# Altium project AX301_AX4010.PrjPCB
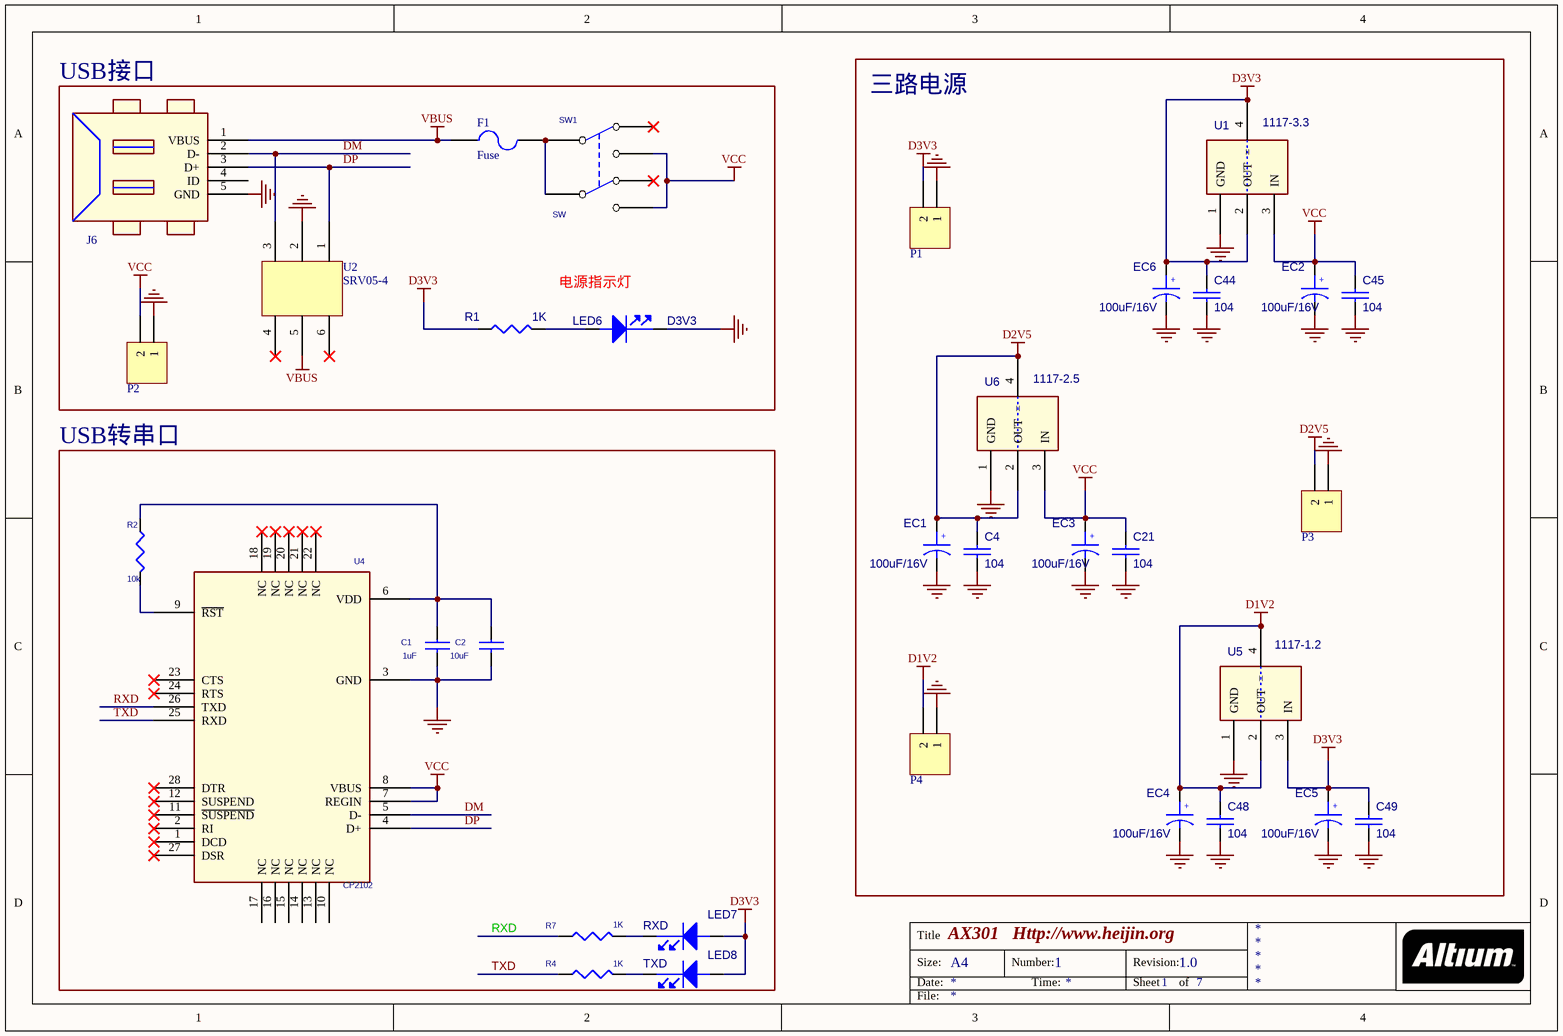
[diagram p0: 1_POWER.SchDoc]
7 sheets, 184 parts. Net scope: global (net labels, ports and power ports of the same name join across sheets).
Sheets:
  1_POWER.SchDoc
  2_FPGA.SchDoc
  3_FPGA.SchDoc
  4_FPGA.SchDoc
  5_SDRAM.SchDoc
  6_DIG.SchDoc
  7_VGA.SchDoc

## Sheet 1_POWER.SchDoc: AX301   Http://www.heijin.org
size A4; DocumentNumber: 1; Revision: 1.0; SheetNumber: 1; SheetTotal: 7; PageSetup: Record=PageOptions|CenterHorizontal=True|CenterVertical=True|PrintScale=1.00|XCorrection=1.00|YCorrection=1.00|PrintKind=0|BorderSize=5000000|LeftOffset=0|BottomOffset=0|Orientation=2|PaperLength=1000|PaperWidth=1000|Scale=100|PaperSource=7|PrintQuality=-4|MediaType=1|DitherType=10|PrintScaleMode=1|PaperKind=A4|PaperIndex=9

### Parts
C1  1uF  [0603]
C2  10uF  [0805]
C4  104  [0402]
C21  104  [0402]
C44  104  [0402]
C45  104  [0402]
C48  104  [0402]
C49  104  [0402]
EC1  100uF/16V  [AEC6.5]
EC2  100uF/16V  [AEC6.5]
EC3  100uF/16V  [AEC6.5]
EC4  100uF/16V  [AEC6.5]
EC5  100uF/16V  [AEC6.5]
EC6  100uF/16V  [AEC6.5]
F1  Fuse  [1812]
J6  EC2  [MINIUSBB]  (value not drawn)
LED6  D3V3  [LEDSO]
LED7  RXD  [LEDSO]
LED8  TXD  [LEDSO]
P1  3.3V  [HDR1X2]  (value not drawn)
P2  5V  [HDR1X2]  (value not drawn)
P3  3.3V  [HDR1X2]  (value not drawn)
P4  1.2V  [HDR1X2]  (value not drawn)
R1  1K  [0603]
R2  10k  [0603]
R4  1K  [0603]
R7  1K  [0603]
SW1  SW  [KEY_DPDT]
U1  1117-3.3  [SOT223]
U2  SRV05-4  [SOT23-6]
U4  CP2102  [QFN28]
U5  1117-1.2  [SOT223]
U6  1117-2.5  [SOT223]

### Blocks framed on the sheet
USB接口: F1 J6 LED6 P2 R1 SW1 U2
三路电源: C4 C21 C44 C45 C48 C49 EC1-EC6 P1 P3 P4 U1 U5 U6
USB转串口: C1 C2 LED7 LED8 R2 R4 R7 U4

### Nets
D1V2: C48.1 EC4.1 P4.2 U5.2(OUT) U5.4(=)
D2V5: C4.1 EC1.1 P3.2 U6.2(OUT) U6.4(=)
D3V3: C44.1 C49.1 EC5.1 EC6.1 LED7.1(ANODE) LED8.1(ANODE) P1.2 R1.1 U1.2(OUT) U1.4(=) U5.3(IN)
GND: C1.2 C2.2 C4.2 C21.2 C44.2 C45.2 C48.2 C49.2 EC1.2 EC2.2 EC3.2 EC4.2 EC5.2 EC6.2 J6.5(GND) LED6.2(CATHODE) P1.1 P2.1 P3.1 P4.1 U1.1(GND) U2.2 U4.3(GND) U5.1(GND) U6.1(GND)
VBUS: F1.1 J6.1(VBUS) U2.5
VCC: C21.1 C45.1 EC2.1 EC3.1 P2.2 SW1.3(NO1) SW1.6(NO2) U1.3(IN) U4.7(REGIN) U4.8(VBUS) U6.3(IN)
DM: J6.2(D-) U2.3 U4.5(D-)
DP: J6.3(D+) U2.1 U4.4(D+)
RXD: R7.1 U4.26(TXD)
TXD: R4.1 U4.25(RXD)
NetC1_1: C1.1 C2.1 R2.2 U4.6(VDD)
NetF1_2: F1.2 SW1.2(COMMON1) SW1.5(COMMON2)
NetLED6_1: LED6.1(ANODE) R1.2
NetLED7_2: LED7.2(CATHODE) R7.2
NetLED8_2: LED8.2(CATHODE) R4.2
NetR2_1: R2.1 U4.9(~{RST})

Not connected (* = marked no-connect by the designer): J6 4(ID); SW1 1(NC1)* 4(NC2)*; U2 4* 6*; U4 1(DCD)* 2(RI)* 10(NC) 11(~{SUSPEND})* 12(SUSPEND)* 13(NC) 14(NC) 15(NC) 16(NC) 17(NC) 18(NC)* 19(NC)* 20(NC)* 21(NC)* 22(NC)* 23(CTS)* 24(RTS)* 27(DSR)* 28(DTR)*

### Notes on the sheet
- 电源指示灯
- Title
- Size:
- Date:
- A4
- Number:
- Time:
- Revision:
- Sheet
- of
- File:
- (in symbol EC) +

### Library data of the parts
C1 C2 = CAP NP_Dup2
C4 C21 C44 C45 C48 C49 = C_Dup4
EC1-EC6 = EC
F1 = Fuse 2: Published: 8-Jun-2000; LatestRevisionDate: 17-Jul-2002; LatestRevisionNote: Re-released for DXP Platform.; PackageReference: PIN-W2/E2.8; Publisher: Altium Limited; PackageDescription: Thru-Hole; 2 Leads
J6 = MiniUSBB: R50: J5
LED6 = LED_Dup1
LED7 LED8 = LED
P1-P4 = Header 2: Header, 2-Pin; LatestRevisionDate: 17-Jul-2002; LatestRevisionNote: Re-released for DXP Platform.; Publisher: Altium Limited
R1 = R
R2 = RESISTOR
R4 R7 = R_Dup3
SW1 = SW KEY-DPDT
U4 = CP2102_0
U5 U6 = 1117-3.3

## Sheet 2_FPGA.SchDoc: AX301 Http://www.heijin.org
size OrCAD A; DocumentNumber: 2; Revision: 1.0; SheetNumber: 2; SheetTotal: 7; PageSetup: Record=PageOptions|CenterHorizontal=True|CenterVertical=True|PrintScale=1.03|XCorrection=1.00|YCorrection=1.00|PrintKind=0|BorderSize=5000000|LeftOffset=0|BottomOffset=0|Orientation=2|PaperLength=1000|PaperWidth=1000|Scale=100|PaperSource=15|PrintQuality=1200|MediaType=1|DitherType=10|PrintScaleMode=1|PaperKind=A4|PaperIndex=9
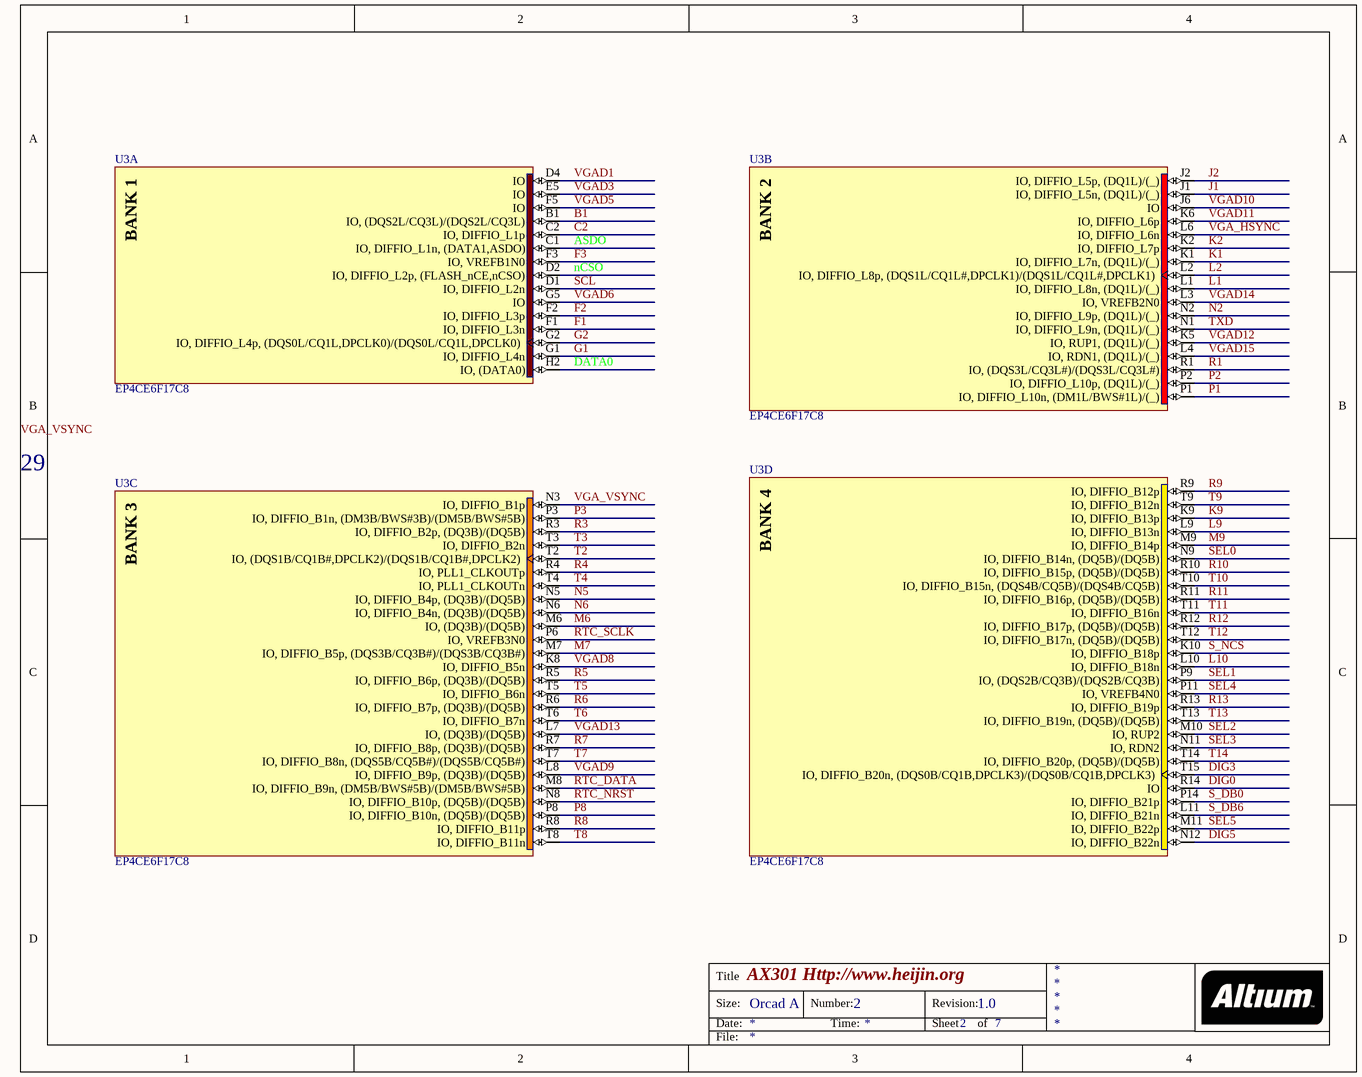
[diagram p1: 2_FPGA.SchDoc]

### Parts
U3  EP4CE6F17C8  [FBGA256]  (parts A,B,C,D of 13)

### Nets
ASDO: U3.C1(IO,_DIFFIO_L1n,_(DATA1,ASDO))
B1: U3.B1(IO,_(DQS2L/CQ3L)/(DQS2L/CQ3L))
C2: U3.C2(IO,_DIFFIO_L1p)
DATA0: U3.H2(IO,_(DATA0))
DIG0: U3.R14(IO)
DIG3: U3.T15(IO,_DIFFIO_B20n,_(DQS0B/CQ1B,DPCLK3)/(DQS0B/CQ1B,DPCLK3))
DIG5: U3.N12(IO,_DIFFIO_B22n)
F1: U3.F1(IO,_DIFFIO_L3n)
F2: U3.F2(IO,_DIFFIO_L3p)
F3: U3.F3(IO,_VREFB1N0)
G1: U3.G1(IO,_DIFFIO_L4n)
G2: U3.G2(IO,_DIFFIO_L4p,_(DQS0L/CQ1L,DPCLK0)/(DQS0L/CQ1L,DPCLK0))
J1: U3.J1(IO,_DIFFIO_L5n,_(DQ1L)/(_))
J2: U3.J2(IO,_DIFFIO_L5p,_(DQ1L)/(_))
K1: U3.K1(IO,_DIFFIO_L7n,_(DQ1L)/(_))
K2: U3.K2(IO,_DIFFIO_L7p)
K9: U3.K9(IO,_DIFFIO_B13p)
L1: U3.L1(IO,_DIFFIO_L8n,_(DQ1L)/(_))
L2: U3.L2(IO,_DIFFIO_L8p,_(DQS1L/CQ1L#,DPCLK1)/(DQS1L/CQ1L#,DPCLK1))
L9: U3.L9(IO,_DIFFIO_B13n)
L10: U3.L10(IO,_DIFFIO_B18n)
M6: U3.M6(IO,_(DQ3B)/(DQ5B))
M7: U3.M7(IO,_DIFFIO_B5p,_(DQS3B/CQ3B#)/(DQS3B/CQ3B#))
M9: U3.M9(IO,_DIFFIO_B14p)
N2: U3.N2(IO,_DIFFIO_L9p,_(DQ1L)/(_))
N5: U3.N5(IO,_DIFFIO_B4p,_(DQ3B)/(DQ5B))
N6: U3.N6(IO,_DIFFIO_B4n,_(DQ3B)/(DQ5B))
nCSO: U3.D2(IO,_DIFFIO_L2p,_(FLASH_nCE,nCSO))
P1: U3.P1(IO,_DIFFIO_L10n,_(DM1L/BWS#1L)/(_))
P2: U3.P2(IO,_DIFFIO_L10p,_(DQ1L)/(_))
P3: U3.P3(IO,_DIFFIO_B1n,_(DM3B/BWS#3B)/(DM5B/BWS#5B))
P8: U3.P8(IO,_DIFFIO_B10n,_(DQ5B)/(DQ5B))
R1: U3.R1(IO,_(DQS3L/CQ3L#)/(DQS3L/CQ3L#))
R3: U3.R3(IO,_DIFFIO_B2p,_(DQ3B)/(DQ5B))
R4: U3.R4(IO,_PLL1_CLKOUTp)
R5: U3.R5(IO,_DIFFIO_B6p,_(DQ3B)/(DQ5B))
R6: U3.R6(IO,_DIFFIO_B7p,_(DQ3B)/(DQ5B))
R7: U3.R7(IO,_DIFFIO_B8p,_(DQ3B)/(DQ5B))
R8: U3.R8(IO,_DIFFIO_B11p)
R9: U3.R9(IO,_DIFFIO_B12p)
R10: U3.R10(IO,_DIFFIO_B15p,_(DQ5B)/(DQ5B))
R11: U3.R11(IO,_DIFFIO_B16p,_(DQ5B)/(DQ5B))
R12: U3.R12(IO,_DIFFIO_B17p,_(DQ5B)/(DQ5B))
R13: U3.R13(IO,_DIFFIO_B19p)
RTC_DATA: U3.M8(IO,_DIFFIO_B9n,_(DM5B/BWS#5B)/(DM5B/BWS#5B))
RTC_NRST: U3.N8(IO,_DIFFIO_B10p,_(DQ5B)/(DQ5B))
RTC_SCLK: U3.P6(IO,_VREFB3N0)
S_DB0: U3.P14(IO,_DIFFIO_B21p)
S_DB6: U3.L11(IO,_DIFFIO_B21n)
S_NCS: U3.K10(IO,_DIFFIO_B18p)
SCL: U3.D1(IO,_DIFFIO_L2n)
SEL0: U3.N9(IO,_DIFFIO_B14n,_(DQ5B)/(DQ5B))
SEL1: U3.P9(IO,_(DQS2B/CQ3B)/(DQS2B/CQ3B))
SEL2: U3.M10(IO,_RUP2)
SEL3: U3.N11(IO,_RDN2)
SEL4: U3.P11(IO,_VREFB4N0)
SEL5: U3.M11(IO,_DIFFIO_B22p)
T2: U3.T2(IO,_(DQS1B/CQ1B#,DPCLK2)/(DQS1B/CQ1B#,DPCLK2))
T3: U3.T3(IO,_DIFFIO_B2n)
T4: U3.T4(IO,_PLL1_CLKOUTn)
T5: U3.T5(IO,_DIFFIO_B6n)
T6: U3.T6(IO,_DIFFIO_B7n)
T7: U3.T7(IO,_DIFFIO_B8n,_(DQS5B/CQ5B#)/(DQS5B/CQ5B#))
T8: U3.T8(IO,_DIFFIO_B11n)
T9: U3.T9(IO,_DIFFIO_B12n)
T10: U3.T10(IO,_DIFFIO_B15n,_(DQS4B/CQ5B)/(DQS4B/CQ5B))
T11: U3.T11(IO,_DIFFIO_B16n)
T12: U3.T12(IO,_DIFFIO_B17n,_(DQ5B)/(DQ5B))
T13: U3.T13(IO,_DIFFIO_B19n,_(DQ5B)/(DQ5B))
T14: U3.T14(IO,_DIFFIO_B20p,_(DQ5B)/(DQ5B))
TXD: U3.N1(IO,_DIFFIO_L9n,_(DQ1L)/(_))
VGA_HSYNC: U3.L6(IO,_DIFFIO_L6n)
VGA_VSYNC: U3.N3(IO,_DIFFIO_B1p)
VGAD1: U3.D4(IO)
VGAD3: U3.E5(IO)
VGAD5: U3.F5(IO)
VGAD6: U3.G5(IO)
VGAD8: U3.K8(IO,_DIFFIO_B5n)
VGAD9: U3.L8(IO,_DIFFIO_B9p,_(DQ3B)/(DQ5B))
VGAD10: U3.J6(IO)
VGAD11: U3.K6(IO,_DIFFIO_L6p)
VGAD12: U3.K5(IO,_RUP1,_(DQ1L)/(_))
VGAD13: U3.L7(IO,_(DQ3B)/(DQ5B))
VGAD14: U3.L3(IO,_VREFB2N0)
VGAD15: U3.L4(IO,_RDN1,_(DQ1L)/(_))

### Notes on the sheet
- 29
- Labels drawn without touching a wire or pin: VGA_VSYNC
- Title
- Size:
- Date:
- Orcad A
- Number:
- Time:
- Revision:
- Sheet
- of
- File:
- (in symbol EP4CE6F17C8, part A) BANK 1
- (in symbol EP4CE6F17C8, part B) BANK 2
- (in symbol EP4CE6F17C8, part C) BANK 3
- (in symbol EP4CE6F17C8, part D) BANK 4

### Library data of the parts
U3 = EP4CE6F17C8: Cyclone IV Family FPGA, 2V Core, 179 I/O Pins, 2 PLLs, 256-Pin FBGA, Speed Grade 8, Commercial Grade; Published: 3-May-2010; DatasheetVersion: ver1.2, Mar-2010; PackageVersion: ver16.0, Dec-2009; PackageReference: FBGA256; Publisher: Altium Limited; PackageDescription: 256-Ball FineLine Ball Grid Array (FBGA256) - Option 1 - Wire Bond; Supplier 1: Digi-Key; Supplier Part Number 1: EP4CE6F17C8-ND; Code_JEDEC: MS-034-AAF-1; Code_IPC: BGA100P16X16-256; ComponentLink1Description: Manufacturer Link; ComponentLink1URL: http://www.altera.com/; ComponentLink2Description: Handbook; ComponentLink2URL: http://www.altera.com/literature/hb/cyclone-iv/cyclone4-handbook.pdf; ComponentLink3Description: Pinout Specification; ComponentLink3URL: http://www.altera.com/literature/lit-dp.jsp?category=cyc%204&showspreadsheet=y; ComponentLink4Description: Packaging Specification; ComponentLink4URL: http://www.altera.com/literature/ds/dspkg.pdf

## Sheet 3_FPGA.SchDoc: AX301  Http://www.heijin.org
size OrCAD A; DocumentNumber: 3; Revision: 1.0; SheetNumber: 3; SheetTotal: 7; PageSetup: Record=PageOptions|CenterHorizontal=True|CenterVertical=True|PrintScale=1.03|XCorrection=1.00|YCorrection=1.00|PrintKind=0|BorderSize=5000000|LeftOffset=0|BottomOffset=0|Orientation=2|PaperLength=1000|PaperWidth=1000|Scale=100|PaperSource=7|PrintQuality=-4|MediaType=1|DitherType=10|PrintScaleMode=1|PaperKind=A4|PaperIndex=9
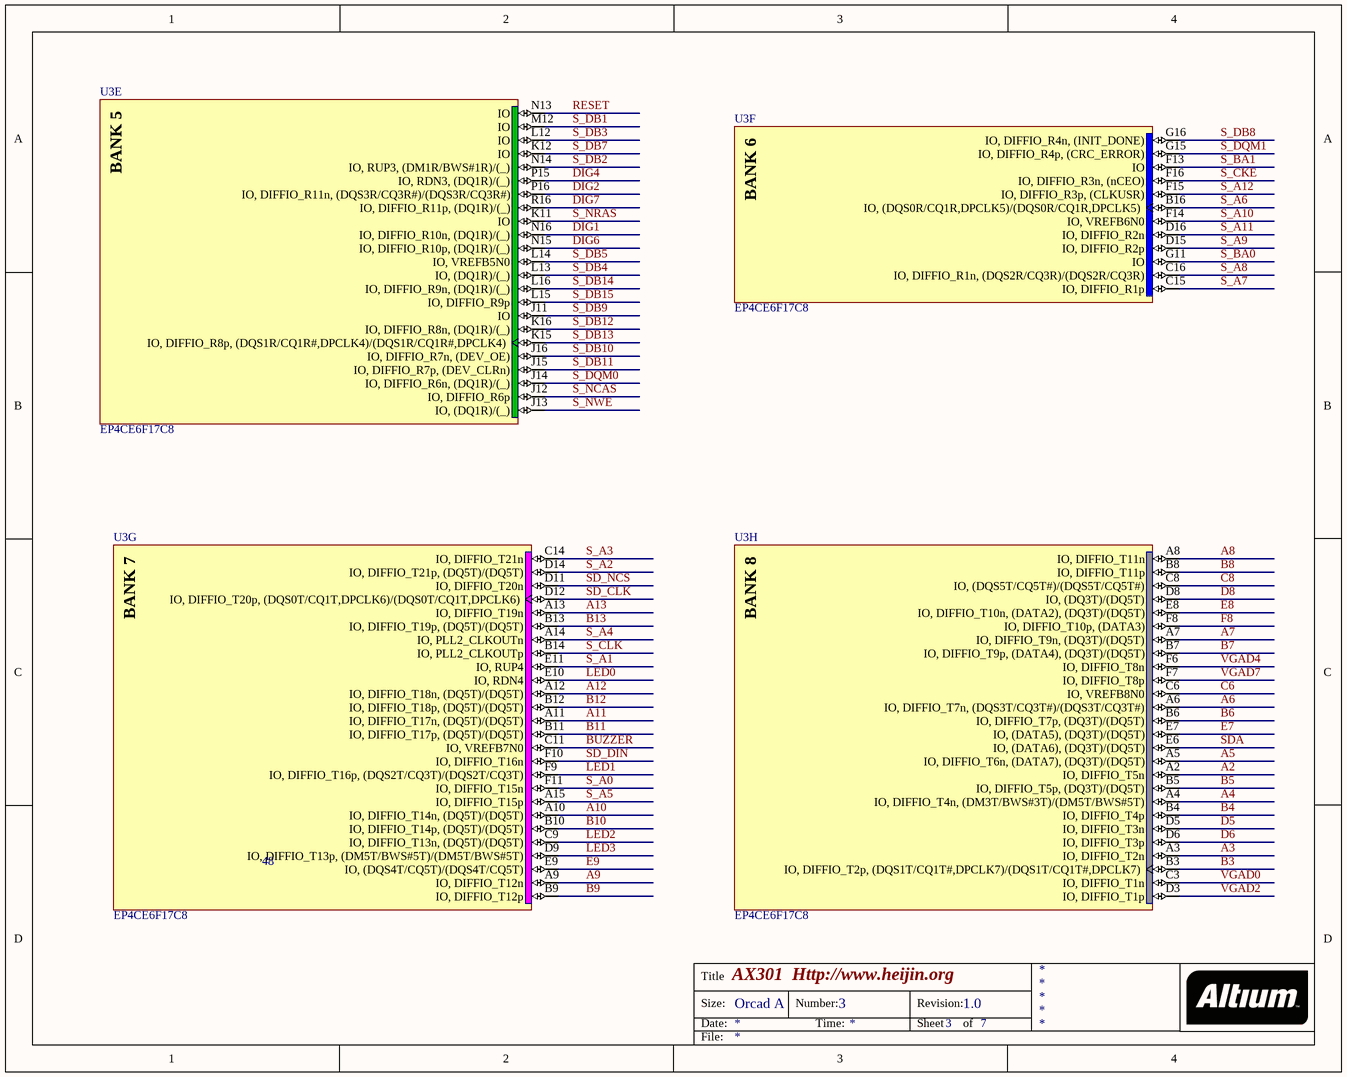
[diagram p2: 3_FPGA.SchDoc]

### Parts
U3  EP4CE6F17C8  [FBGA256]  (parts E,F,G,H of 13)

### Nets
A2: U3.A2(IO,_DIFFIO_T5n)
A3: U3.A3(IO,_DIFFIO_T2n)
A4: U3.A4(IO,_DIFFIO_T4n,_(DM3T/BWS#3T)/(DM5T/BWS#5T))
A5: U3.A5(IO,_DIFFIO_T6n,_(DATA7),_(DQ3T)/(DQ5T))
A6: U3.A6(IO,_DIFFIO_T7n,_(DQS3T/CQ3T#)/(DQS3T/CQ3T#))
A7: U3.A7(IO,_DIFFIO_T9n,_(DQ3T)/(DQ5T))
A8: U3.A8(IO,_DIFFIO_T11n)
A9: U3.A9(IO,_DIFFIO_T12n)
A10: U3.A10(IO,_DIFFIO_T14n,_(DQ5T)/(DQ5T))
A11: U3.A11(IO,_DIFFIO_T17n,_(DQ5T)/(DQ5T))
A12: U3.A12(IO,_DIFFIO_T18n,_(DQ5T)/(DQ5T))
A13: U3.A13(IO,_DIFFIO_T19n)
B3: U3.B3(IO,_DIFFIO_T2p,_(DQS1T/CQ1T#,DPCLK7)/(DQS1T/CQ1T#,DPCLK7))
B4: U3.B4(IO,_DIFFIO_T4p)
B5: U3.B5(IO,_DIFFIO_T5p,_(DQ3T)/(DQ5T))
B6: U3.B6(IO,_DIFFIO_T7p,_(DQ3T)/(DQ5T))
B7: U3.B7(IO,_DIFFIO_T9p,_(DATA4),_(DQ3T)/(DQ5T))
B8: U3.B8(IO,_DIFFIO_T11p)
B9: U3.B9(IO,_DIFFIO_T12p)
B10: U3.B10(IO,_DIFFIO_T14p,_(DQ5T)/(DQ5T))
B11: U3.B11(IO,_DIFFIO_T17p,_(DQ5T)/(DQ5T))
B12: U3.B12(IO,_DIFFIO_T18p,_(DQ5T)/(DQ5T))
B13: U3.B13(IO,_DIFFIO_T19p,_(DQ5T)/(DQ5T))
BUZZER: U3.C11(IO,_VREFB7N0)
C6: U3.C6(IO,_VREFB8N0)
C8: U3.C8(IO,_(DQS5T/CQ5T#)/(DQS5T/CQ5T#))
D5: U3.D5(IO,_DIFFIO_T3n)
D6: U3.D6(IO,_DIFFIO_T3p)
D8: U3.D8(IO,_(DQ3T)/(DQ5T))
DIG1: U3.N16(IO,_DIFFIO_R10n,_(DQ1R)/(_))
DIG2: U3.P16(IO,_DIFFIO_R11n,_(DQS3R/CQ3R#)/(DQS3R/CQ3R#))
DIG4: U3.P15(IO,_RDN3,_(DQ1R)/(_))
DIG6: U3.N15(IO,_DIFFIO_R10p,_(DQ1R)/(_))
DIG7: U3.R16(IO,_DIFFIO_R11p,_(DQ1R)/(_))
E7: U3.E7(IO,_(DATA5),_(DQ3T)/(DQ5T))
E8: U3.E8(IO,_DIFFIO_T10n,_(DATA2),_(DQ3T)/(DQ5T))
E9: U3.E9(IO,_(DQS4T/CQ5T)/(DQS4T/CQ5T))
F8: U3.F8(IO,_DIFFIO_T10p,_(DATA3))
LED0: U3.E10(IO,_RDN4)
LED1: U3.F9(IO,_DIFFIO_T16p,_(DQS2T/CQ3T)/(DQS2T/CQ3T))
LED2: U3.C9(IO,_DIFFIO_T13n,_(DQ5T)/(DQ5T))
LED3: U3.D9(IO,_DIFFIO_T13p,_(DM5T/BWS#5T)/(DM5T/BWS#5T))
RESET: U3.N13(IO)
S_A0: U3.F11(IO,_DIFFIO_T15n)
S_A1: U3.E11(IO,_RUP4)
S_A2: U3.D14(IO,_DIFFIO_T21p,_(DQ5T)/(DQ5T))
S_A3: U3.C14(IO,_DIFFIO_T21n)
S_A4: U3.A14(IO,_PLL2_CLKOUTn)
S_A5: U3.A15(IO,_DIFFIO_T15p)
S_A6: U3.B16(IO,_(DQS0R/CQ1R,DPCLK5)/(DQS0R/CQ1R,DPCLK5))
S_A7: U3.C15(IO,_DIFFIO_R1p)
S_A8: U3.C16(IO,_DIFFIO_R1n,_(DQS2R/CQ3R)/(DQS2R/CQ3R))
S_A9: U3.D15(IO,_DIFFIO_R2p)
S_A10: U3.F14(IO,_VREFB6N0)
S_A11: U3.D16(IO,_DIFFIO_R2n)
S_A12: U3.F15(IO,_DIFFIO_R3p,_(CLKUSR))
S_BA0: U3.G11(IO)
S_BA1: U3.F13(IO)
S_CKE: U3.F16(IO,_DIFFIO_R3n,_(nCEO))
S_CLK: U3.B14(IO,_PLL2_CLKOUTp)
S_DB1: U3.M12(IO)
S_DB2: U3.N14(IO,_RUP3,_(DM1R/BWS#1R)/(_))
S_DB3: U3.L12(IO)
S_DB4: U3.L13(IO,_(DQ1R)/(_))
S_DB5: U3.L14(IO,_VREFB5N0)
S_DB7: U3.K12(IO)
S_DB8: U3.G16(IO,_DIFFIO_R4n,_(INIT_DONE))
S_DB9: U3.J11(IO)
S_DB10: U3.J16(IO,_DIFFIO_R7n,_(DEV_OE))
S_DB11: U3.J15(IO,_DIFFIO_R7p,_(DEV_CLRn))
S_DB12: U3.K16(IO,_DIFFIO_R8n,_(DQ1R)/(_))
S_DB13: U3.K15(IO,_DIFFIO_R8p,_(DQS1R/CQ1R#,DPCLK4)/(DQS1R/CQ1R#,DPCLK4))
S_DB14: U3.L16(IO,_DIFFIO_R9n,_(DQ1R)/(_))
S_DB15: U3.L15(IO,_DIFFIO_R9p)
S_DQM0: U3.J14(IO,_DIFFIO_R6n,_(DQ1R)/(_))
S_DQM1: U3.G15(IO,_DIFFIO_R4p,_(CRC_ERROR))
S_NCAS: U3.J12(IO,_DIFFIO_R6p)
S_NRAS: U3.K11(IO)
S_NWE: U3.J13(IO,_(DQ1R)/(_))
SD_CLK: U3.D12(IO,_DIFFIO_T20p,_(DQS0T/CQ1T,DPCLK6)/(DQS0T/CQ1T,DPCLK6))
SD_DIN: U3.F10(IO,_DIFFIO_T16n)
SD_NCS: U3.D11(IO,_DIFFIO_T20n)
SDA: U3.E6(IO,_(DATA6),_(DQ3T)/(DQ5T))
VGAD0: U3.C3(IO,_DIFFIO_T1n)
VGAD2: U3.D3(IO,_DIFFIO_T1p)
VGAD4: U3.F6(IO,_DIFFIO_T8n)
VGAD7: U3.F7(IO,_DIFFIO_T8p)

### Notes on the sheet
- 48
- Title
- Size:
- Date:
- Orcad A
- Number:
- Time:
- Revision:
- Sheet
- of
- File:
- (in symbol EP4CE6F17C8, part E) BANK 5
- (in symbol EP4CE6F17C8, part F) BANK 6
- (in symbol EP4CE6F17C8, part G) BANK 7
- (in symbol EP4CE6F17C8, part H) BANK 8

### Library data of the parts
U3 = EP4CE6F17C8: as U3 on sheet 2_FPGA; Published: 3-May-2010; DatasheetVersion: ver1.2, Mar-2010; PackageVersion: ver16.0, Dec-2009; PackageReference: FBGA256; Publisher: Altium Limited; PackageDescription: 256-Ball FineLine Ball Grid Array (FBGA256) - Option 1 - Wire Bond; Supplier 1: Digi-Key; Supplier Part Number 1: EP4CE6F17C8-ND; Code_JEDEC: MS-034-AAF-1; Code_IPC: BGA100P16X16-256; ComponentLink1Description: Manufacturer Link; ComponentLink1URL: http://www.altera.com/; ComponentLink2Description: Handbook; ComponentLink2URL: http://www.altera.com/literature/hb/cyclone-iv/cyclone4-handbook.pdf; ComponentLink3Description: Pinout Specification; ComponentLink3URL: http://www.altera.com/literature/lit-dp.jsp?category=cyc%204&showspreadsheet=y; ComponentLink4Description: Packaging Specification; ComponentLink4URL: http://www.altera.com/literature/ds/dspkg.pdf

## Sheet 4_FPGA.SchDoc: AX301 Http://www.heijin.org
size OrCAD B; DocumentNumber: 4; SheetNumber: 4; SheetTotal: 7; PageSetup: Record=PageOptions|CenterHorizontal=True|CenterVertical=True|PrintScale=0.75|XCorrection=1.00|YCorrection=1.00|PrintKind=0|BorderSize=5000000|LeftOffset=0|BottomOffset=0|Orientation=2|PaperLength=1000|PaperWidth=1000|Scale=100|PaperSource=7|PrintQuality=-4|MediaType=1|DitherType=10|PrintScaleMode=1|PaperKind=A4|PaperIndex=9
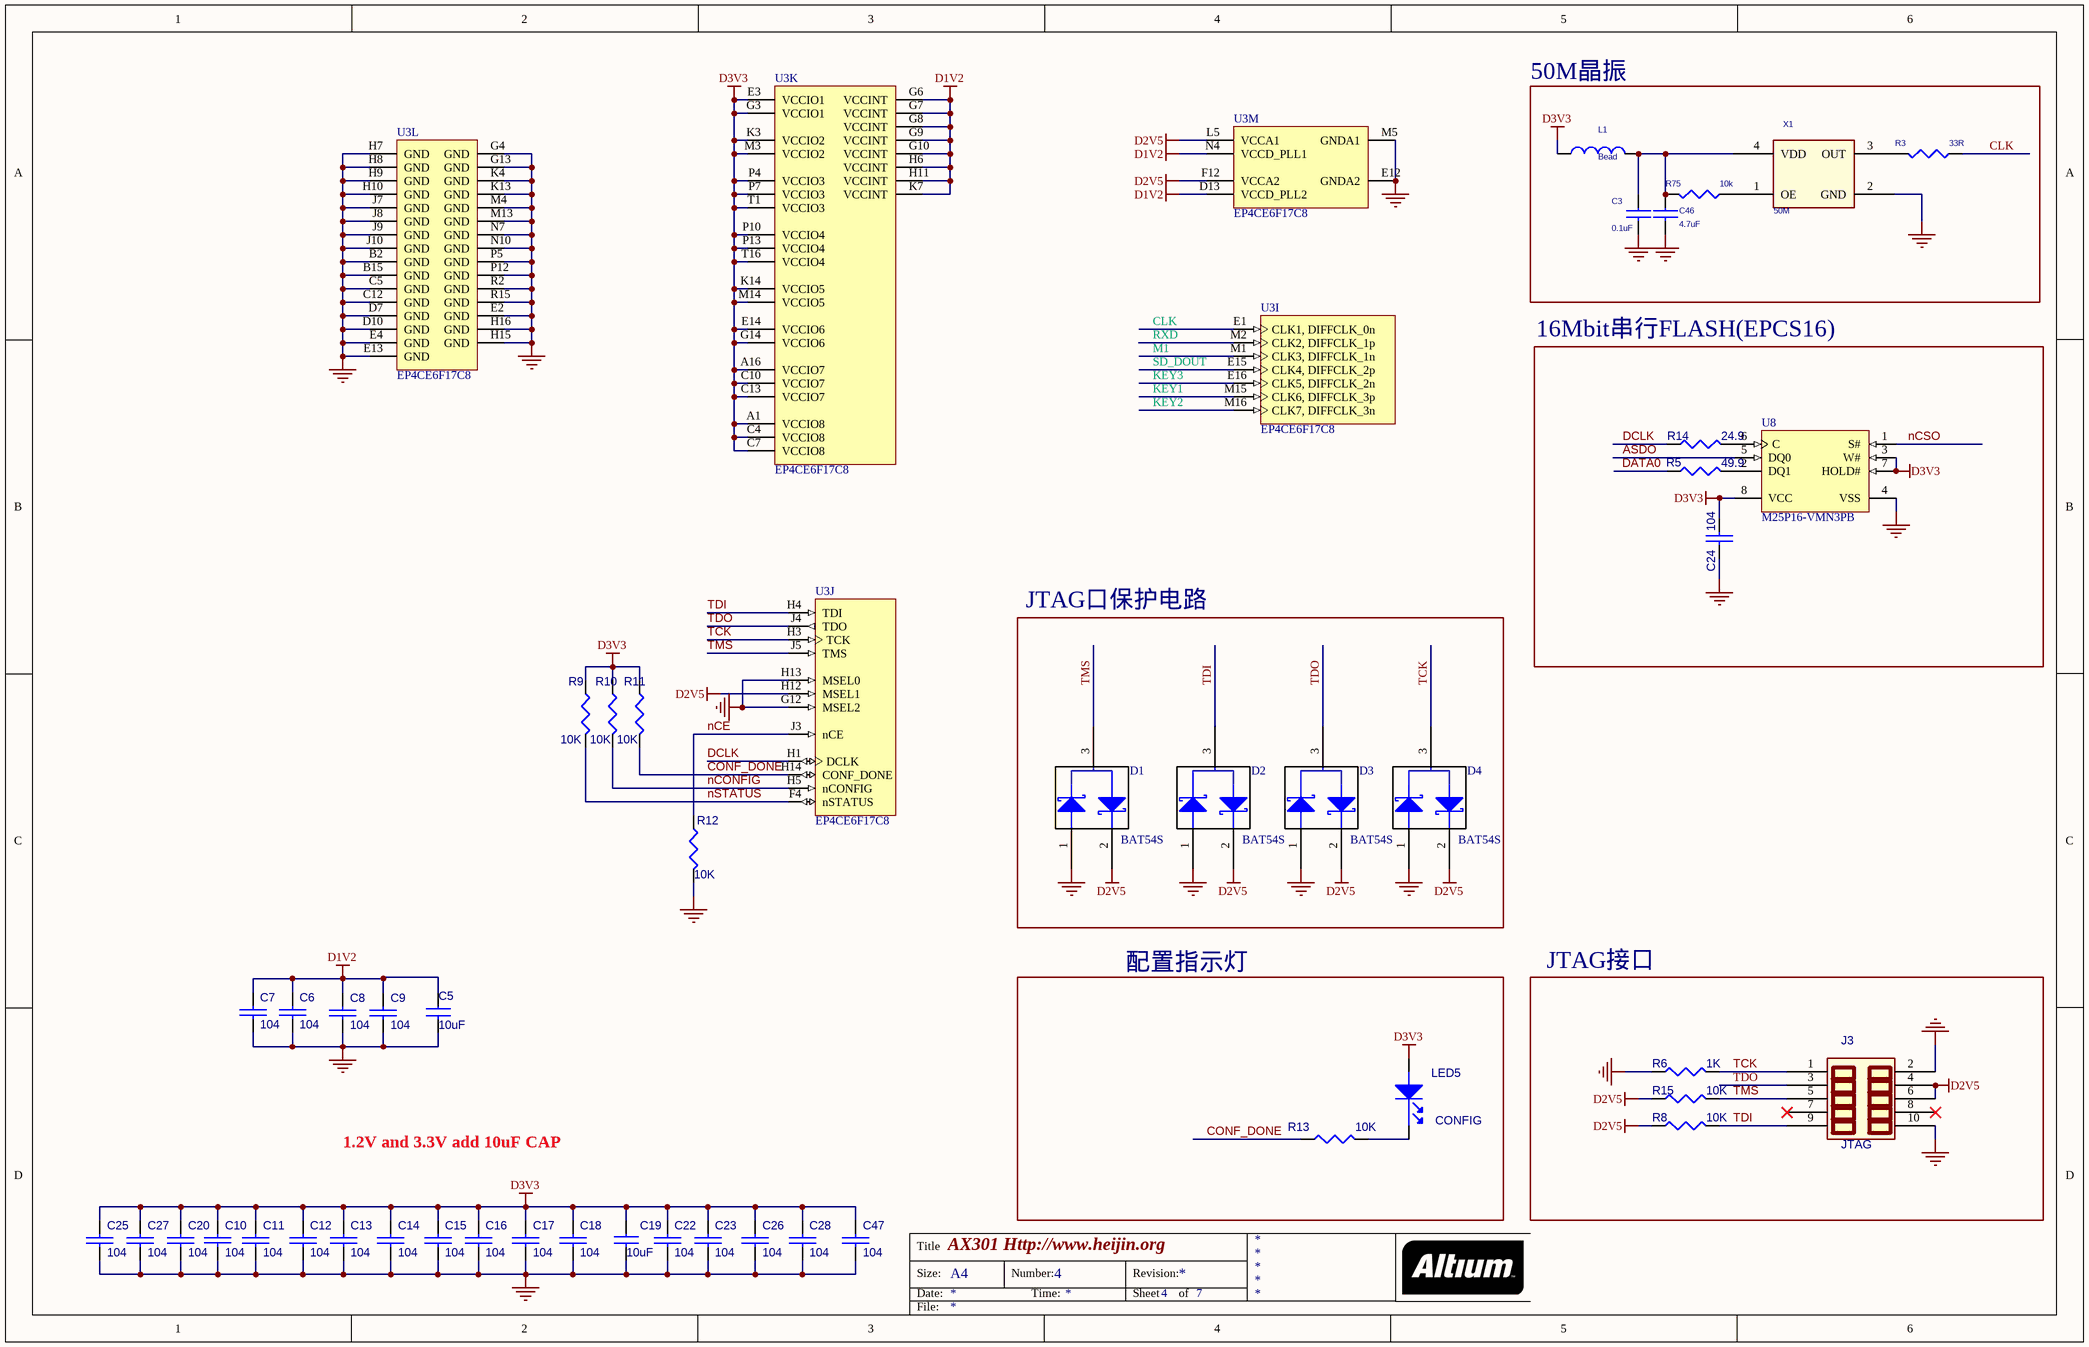
[diagram p3: 4_FPGA.SchDoc]

### Parts
C3  0.1uF  [0402]
C5  10uF  [0805]
C6  104  [0402]
C7  104  [0402]
C8  104  [0402]
C9  104  [0402]
C10  104  [0402]
C11  104  [0402]
C12  104  [0402]
C13  104  [0402]
C14  104  [0402]
C15  104  [0402]
C16  104  [0402]
C17  104  [0402]
C18  104  [0402]
C19  10uF  [0805]
C20  104  [0402]
C22  104  [0402]
C23  104  [0402]
C24  104  [0402]
C25  104  [0402]
C26  104  [0402]
C27  104  [0402]
C28  104  [0402]
C46  4.7uF  [0603]
C47  104  [0402]
D1  BAT54S  [SOT23]
D2  BAT54S  [SOT23]
D3  BAT54S  [SOT23]
D4  BAT54S  [SOT23]
J3  JTAG  [JTAG-10]
L1  Bead  [0603]
LED5  CONFIG  [LEDSO]
R3  33R  [0603]
R5  49.9  [0603]
R6  1K  [0603]
R8  10K  [0603]
R9  10K  [0603]
R10  10K  [0603]
R11  10K  [0603]
R12  10K  [0603]
R13  10K  [0603]
R14  24.9  [0603]
R15  10K  [0603]
R75  10k  [0603]
U3  EP4CE6F17C8  [FBGA256]  (parts I,J,K,L,M of 13)
U8  M25P16-VMN3PB  [SO8]
X1  50M  [CY_4]

### Blocks framed on the sheet
50M晶振: C3 C46 L1 R3 R75 X1
16Mbit串行FLASH(EPCS16): C24 R5 R14 U8
JTAG口保护电路: D1-D4
配置指示灯: LED5 R13
JTAG接口: J3 R6 R8 R15

### Nets
D1V2: C5.1 C6.1 C7.1 C8.1 C9.1 U3.D13(VCCD_PLL2) U3.G6(VCCINT) U3.G7(VCCINT) U3.G8(VCCINT) U3.G9(VCCINT) U3.G10(VCCINT) U3.H6(VCCINT) U3.H11(VCCINT) U3.K7(VCCINT) U3.N4(VCCD_PLL1)
D2V5: D1.2 D2.2 D3.2 D4.2 J3.4 J3.6 R8.1 R15.1 U3.F12(VCCA2) U3.H12(MSEL1) U3.L5(VCCA1)
D3V3: C10.1 C11.1 C12.1 C13.1 C14.1 C15.1 C16.1 C17.1 C18.1 C19.1 C20.1 C22.1 C23.1 C24.2 C25.1 C26.1 C27.1 C28.1 C47.1 L1.1 LED5.1(ANODE) R9.1 R10.1 R11.1 U3.A1(VCCIO8) U3.A16(VCCIO7) U3.C4(VCCIO8) U3.C7(VCCIO8) U3.C10(VCCIO7) U3.C13(VCCIO7) U3.E3(VCCIO1) U3.E14(VCCIO6) U3.G3(VCCIO1) U3.G14(VCCIO6) U3.K3(VCCIO2) U3.K14(VCCIO5) U3.M3(VCCIO2) U3.M14(VCCIO5) U3.P4(VCCIO3) U3.P7(VCCIO3) U3.P10(VCCIO4) U3.P13(VCCIO4) U3.T1(VCCIO3) U3.T16(VCCIO4) U8.3(W#) U8.7(HOLD#) U8.8(VCC)
GND: C3.2 C5.2 C6.2 C7.2 C8.2 C9.2 C10.2 C11.2 C12.2 C13.2 C14.2 C15.2 C16.2 C17.2 C18.2 C19.2 C20.2 C22.2 C23.2 C24.1 C25.2 C26.2 C27.2 C28.2 C46.2 C47.2 D1.1 D2.1 D3.1 D4.1 J3.2 J3.10 R6.1 R12.2 U3.B2(GND) U3.B15(GND) U3.C5(GND) U3.C12(GND) U3.D7(GND) U3.D10(GND) U3.E2(GND) U3.E4(GND) U3.E12(GNDA2) U3.E13(GND) U3.G4(GND) U3.G12(MSEL2) U3.G13(GND) U3.H7(GND) U3.H8(GND) U3.H9(GND) U3.H10(GND) U3.H13(MSEL0) U3.H15(GND) U3.H16(GND) U3.J7(GND) U3.J8(GND) U3.J9(GND) U3.J10(GND) U3.K4(GND) U3.K13(GND) U3.M4(GND) U3.M5(GNDA1) U3.M13(GND) U3.N7(GND) U3.N10(GND) U3.P5(GND) U3.P12(GND) U3.R2(GND) U3.R15(GND) U8.4(VSS) X1.2(GND)
ASDO: U8.5(DQ0)
CLK: R3.1 U3.E1(CLK1,_DIFFCLK_0n)
CONF_DONE: R11.2 R13.1 U3.H14(CONF_DONE)
DATA0: R5.1
DCLK: R14.1 U3.H1(DCLK)
KEY1: U3.M15(CLK6,_DIFFCLK_3p)
KEY2: U3.M16(CLK7,_DIFFCLK_3n)
KEY3: U3.E16(CLK5,_DIFFCLK_2n)
M1: U3.M1(CLK3,_DIFFCLK_1n)
nCE: R12.1 U3.J3(nCE)
nCONFIG: R10.2 U3.H5(nCONFIG)
nCSO: U8.1(S#)
nSTATUS: R9.2 U3.F4(nSTATUS)
RXD: U3.M2(CLK2,_DIFFCLK_1p)
SD_DOUT: U3.E15(CLK4,_DIFFCLK_2p)
TCK: D4.3 J3.1 R6.2 U3.H3(TCK)
TDI: D2.3 J3.9 R8.2 U3.H4(TDI)
TDO: D3.3 J3.3 U3.J4(TDO)
TMS: D1.3 J3.5 R15.2 U3.J5(TMS)
NetC3_1: C3.1 C46.1 L1.2 R75.2 X1.4(VDD)
NetLED5_2: LED5.2(CATHODE) R13.2
NetR3_2: R3.2 X1.3(OUT)
NetR5_2: R5.2 U8.2(DQ1)
NetR14_2: R14.2 U8.6(C)
NetR75_1: R75.1 X1.1(OE)

Not connected (* = marked no-connect by the designer): J3 7* 8*

### Notes on the sheet
- 1.2V and 3.3V add 10uF CAP
- Title
- Size:
- Date:
- A4
- Number:
- Time:
- Revision:
- Sheet
- of
- File:

### Library data of the parts
C3 C5 C19 C46 = CAP NP_Dup2
C6-C18 C20 C22-C28 C47 = C_Dup4
D1-D4 = BAV99
J3 = JTAG-10_Dup1
L1 = INDUCTOR
LED5 = LED_Dup1
R3 R75 = RESISTOR
R5 R9-R12 R14 = R_Dup3
R6 R8 R15 = R_Dup2
R13 = R_Dup1
U3 = EP4CE6F17C8: as U3 on sheet 2_FPGA; Published: 3-May-2010; DatasheetVersion: ver1.2, Mar-2010; PackageVersion: ver16.0, Dec-2009; PackageReference: FBGA256; Publisher: Altium Limited; PackageDescription: 256-Ball FineLine Ball Grid Array (FBGA256) - Option 1 - Wire Bond; Supplier 1: Digi-Key; Supplier Part Number 1: EP4CE6F17C8-ND; Code_JEDEC: MS-034-AAF-1; Code_IPC: BGA100P16X16-256; ComponentLink1Description: Manufacturer Link; ComponentLink1URL: http://www.altera.com/; ComponentLink2Description: Handbook; ComponentLink2URL: http://www.altera.com/literature/hb/cyclone-iv/cyclone4-handbook.pdf; ComponentLink3Description: Pinout Specification; ComponentLink3URL: http://www.altera.com/literature/lit-dp.jsp?category=cyc%204&showspreadsheet=y; ComponentLink4Description: Packaging Specification; ComponentLink4URL: http://www.altera.com/literature/ds/dspkg.pdf
U8 = M25P16-VMN3PB: 16 Mb (x1) Automotive Serial NOR Flash Memory, 75 MHz, 2.7 to 3.6 V, 8-pin SO8 Narrow (MN), Tube; Part Family: M25P爘ISHIDDEN=T; Manufacturer: Micron; Density: 16Mb爘ISHIDDEN=T; Speed: 75 MHz爘ISHIDDEN=T; Voltage: 2.7V-3.6V爘ISHIDDEN=T; DatasheetVersion: Rev. Y; PackageVersion: Rev 11; PackageReference: MICT-MN-8; PackageDescription: 8-Pin SO Narrow, 3.9 X 4.9 mm, Pitch 1.27 mm; Applications: Automotive爘ISHIDDEN=T; Package: SO8 Narrow爘ISHIDDEN=T; Part Status: Production爘ISHIDDEN=T; RoHS: Yes爘ISHIDDEN=T; Type: Data Storage爘ISHIDDEN=T; Width: x1爘ISHIDDEN=T; Mounting Technology: Surface Mount; PartNumber: M25P16-VMN3PB; ComponentLink1Description: Manufacturer URL; ComponentLink1URL: http://www.micron.com/; ComponentLink2Description: Datasheet; ComponentLink2URL: http://www.micron.com/~/media/Documents/Products/Data%20Sheet/NOR%20Flash/Serial%20NOR/M25P/M25P16.pdf; ComponentLink3Description: Package Specification; ComponentLink3URL: http://www.micron.com/~/media/Documents/Products/Data%20Sheet/NOR%20Flash/Serial%20NOR/M25P/M25P05A.pdf
X1 = OSC

## Sheet 5_SDRAM.SchDoc: AX301  Http://www.heijin.org
size OrCAD A; DocumentNumber: 5; SheetNumber: 5; SheetTotal: 7; PageSetup: Record=PageOptions|CenterHorizontal=True|CenterVertical=True|PrintScale=1.03|XCorrection=1.00|YCorrection=1.00|PrintKind=0|BorderSize=5000000|LeftOffset=0|BottomOffset=0|Orientation=2|PaperLength=1000|PaperWidth=1000|Scale=100|PaperSource=7|PrintQuality=-4|MediaType=1|DitherType=10|PrintScaleMode=1|PaperKind=A4|PaperIndex=9
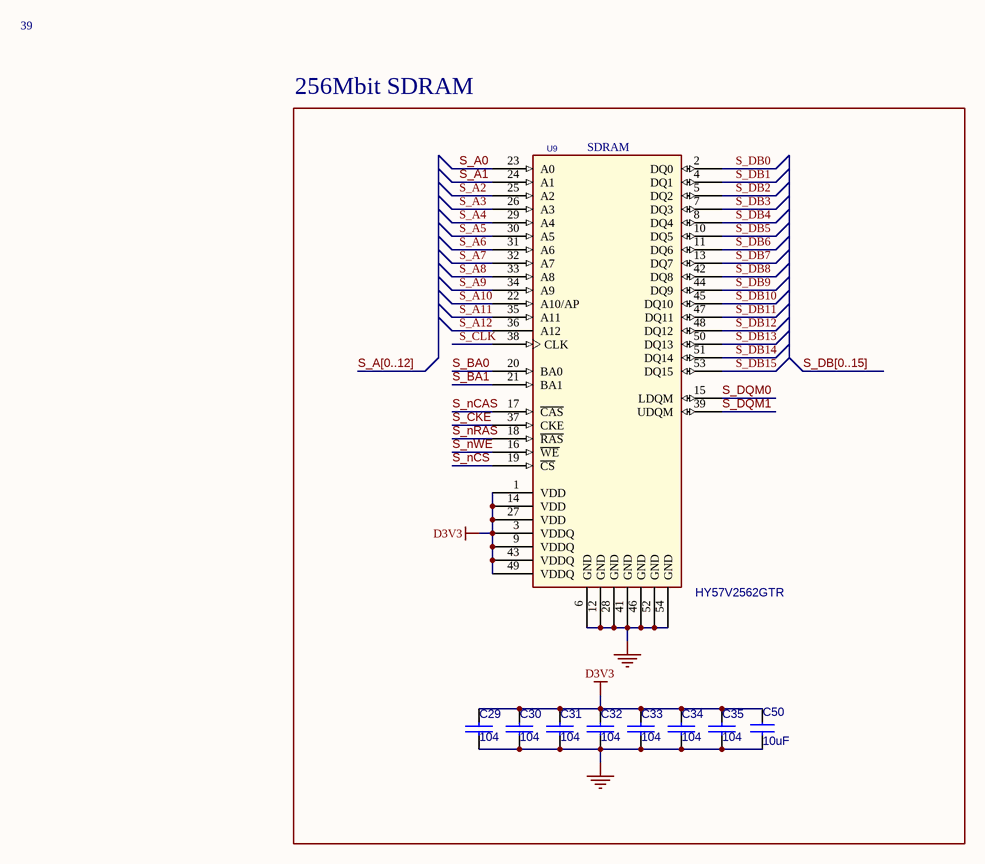
[diagram p4: 5_SDRAM.SchDoc]

### Parts
C29  104  [0402]
C30  104  [0402]
C31  104  [0402]
C32  104  [0402]
C33  104  [0402]
C34  104  [0402]
C35  104  [0402]
C50  10uF  [0805]
U9  HY57V2562GTR  [TSOP-54]

### Nets
D3V3: C29.1 C30.1 C31.1 C32.1 C33.1 C34.1 C35.1 C50.1 U9.1(VDD) U9.3(VDDQ) U9.9(VDDQ) U9.14(VDD) U9.27(VDD) U9.43(VDDQ) U9.49(VDDQ)
GND: C29.2 C30.2 C31.2 C32.2 C33.2 C34.2 C35.2 C50.2 U9.6(GND) U9.12(GND) U9.28(GND) U9.41(GND) U9.46(GND) U9.52(GND) U9.54(GND)
S_A0: U9.23(A0)
S_A1: U9.24(A1)
S_A2: U9.25(A2)
S_A3: U9.26(A3)
S_A4: U9.29(A4)
S_A5: U9.30(A5)
S_A6: U9.31(A6)
S_A7: U9.32(A7)
S_A8: U9.33(A8)
S_A9: U9.34(A9)
S_A10: U9.22(A10/AP)
S_A11: U9.35(A11)
S_A12: U9.36(A12)
S_BA0: U9.20(BA0)
S_BA1: U9.21(BA1)
S_CKE: U9.37(CKE)
S_CLK: U9.38(CLK)
S_DB0: U9.2(DQ0)
S_DB1: U9.4(DQ1)
S_DB2: U9.5(DQ2)
S_DB3: U9.7(DQ3)
S_DB4: U9.8(DQ4)
S_DB5: U9.10(DQ5)
S_DB6: U9.11(DQ6)
S_DB7: U9.13(DQ7)
S_DB8: U9.42(DQ8)
S_DB9: U9.44(DQ9)
S_DB10: U9.45(DQ10)
S_DB11: U9.47(DQ11)
S_DB12: U9.48(DQ12)
S_DB13: U9.50(DQ13)
S_DB14: U9.51(DQ14)
S_DB15: U9.53(DQ15)
S_DQM0: U9.15(LDQM)
S_DQM1: U9.39(UDQM)
S_NCAS: U9.17(~{CAS})
S_NCS: U9.19(~{CS})
S_NRAS: U9.18(~{RAS})
S_NWE: U9.16(~{WE})

### Buses and harness runs
bus S_A[0..12]
bus S_DB[0..15]

### Notes on the sheet
- 39
- 256Mbit SDRAM
- (near U9) SDRAM
- Title
- Size:
- Date:
- Orcad A
- Number:
- Time:
- Revision:
- Sheet
- of
- File:

### Library data of the parts
C29-C35 = C_Dup2
C50 = CAP NP_Dup2
U9 = HY57651620/SO_0

## Sheet 6_DIG.SchDoc: AX301  Http://www.heijin.org
size OrCAD B; DocumentNumber: 6; SheetNumber: 6; SheetTotal: 7; PageSetup: Record=PageOptions|CenterHorizontal=True|CenterVertical=True|PrintScale=0.75|XCorrection=1.00|YCorrection=1.00|PrintKind=0|BorderSize=5000000|LeftOffset=0|BottomOffset=0|Orientation=2|PaperLength=1000|PaperWidth=1000|Scale=100|PaperSource=7|PrintQuality=-4|MediaType=1|DitherType=10|PrintScaleMode=1|PaperKind=A4|PaperIndex=9
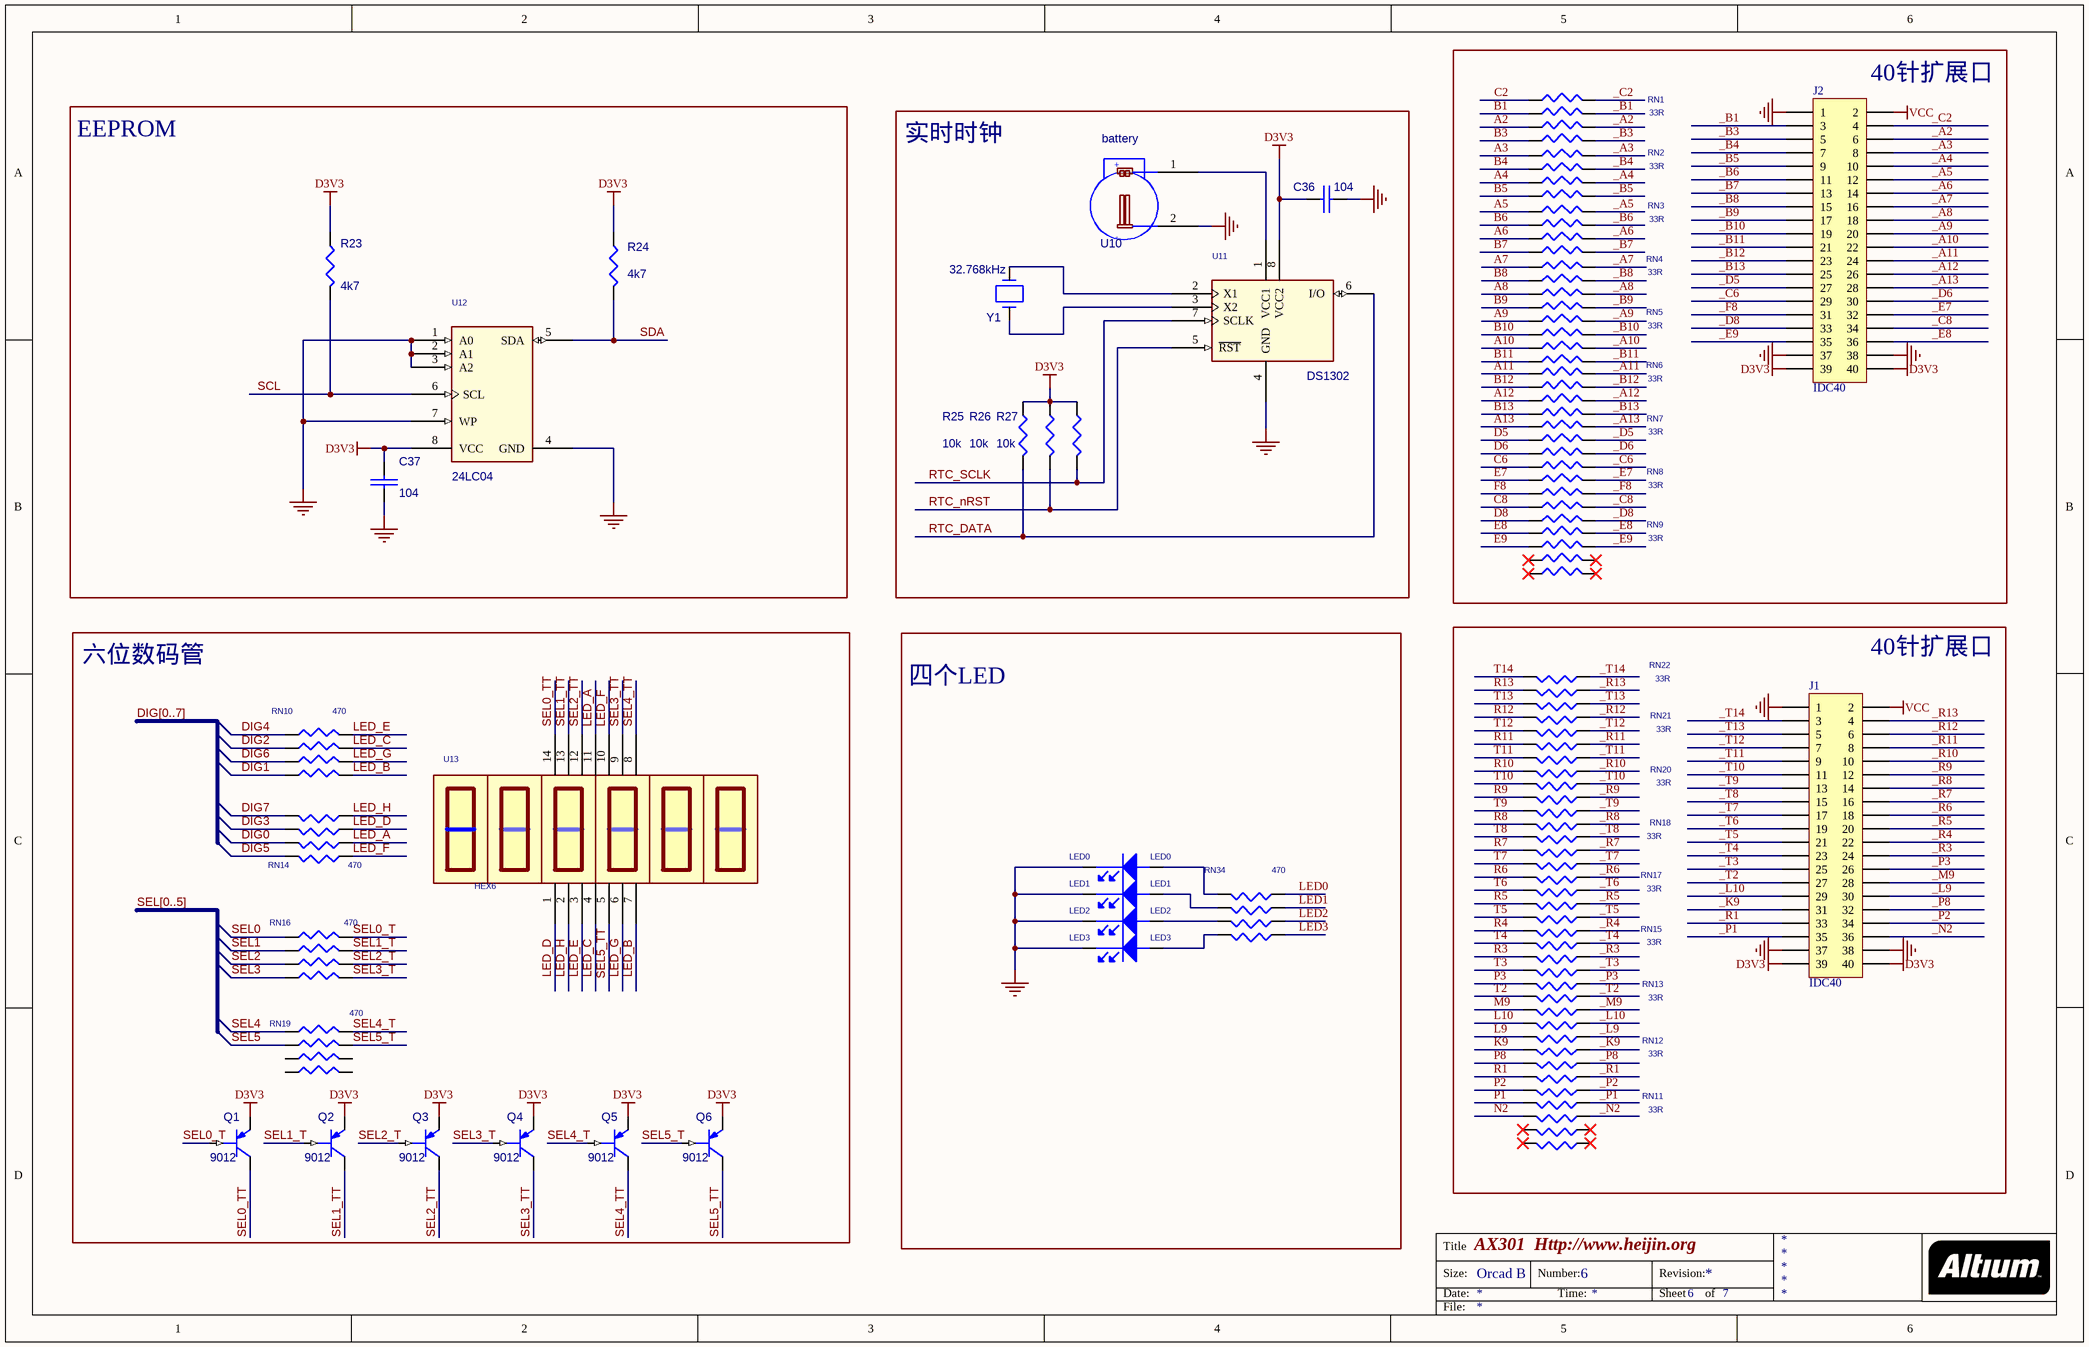
[diagram p5: 6_DIG.SchDoc]

### Parts
C36  104  [0402]
C37  104  [0402]
J1  IDC40  [IDC-40J]
J2  IDC40  [IDC-40J]
LED0  LED0  [LEDSO]
LED1  LED1  [LEDso]
LED2  LED2  [LEDSO]
LED3  LED3  [LEDSO]
Q1  9012  [SOT23]
Q2  9012  [SOT23]
Q3  9012  [SOT23]
Q4  9012  [SOT23]
Q5  9012  [SOT23]
Q6  9012  [SOT23]
R23  4k7  [0603]
R24  4k7  [0603]
R25  10k  [0603]
R26  10k  [0603]
R27  10k  [0603]
RN1  33R  [RN-8P]
RN2  33R  [RN-8P]
RN3  33R  [RN-8P]
RN4  33R  [RN-8P]
RN5  33R  [RN-8P]
RN6  33R  [RN-8P]
RN7  33R  [RN-8P]
RN8  33R  [RN-8P]
RN9  33R  [RN-8P]
RN10  470  [RN-8P]
RN11  33R  [RN-8P]
RN12  33R  [RN-8P]
RN13  33R  [RN-8P]
RN14  470  [RN-8P]
RN15  33R  [RN-8P]
RN16  470  [RN-8P]
RN17  33R  [RN-8P]
RN18  33R  [RN-8P]
RN19  470  [RN-8P]
RN20  33R  [RN-8P]
RN21  33R  [RN-8P]
RN22  33R  [RN-8P]
RN34  470  [RN-8P]
U10  battery  [BATSO]
U11  DS1302  [SO8]
U12  24LC04  [SO8]
U13  HEX6  [NIX_6]
Y1  32.768kHz  [CY_SMALL]

### Blocks framed on the sheet
40针扩展口: J2 RN1-RN9
EEPROM: C37 R23 R24 U12
实时时钟: C36 R25-R27 U10 U11 Y1
六位数码管: Q1-Q6 RN10 RN14 RN16 RN19 U13
四个LED: LED0-LED3 RN34
40针扩展口: J1 RN11-RN13 RN15 RN17 RN18 RN20-RN22

### Nets
D3V3: C36.1 C37.1 J1.39 J1.40 J2.39 J2.40 Q1.2(EMITTER) Q2.2(EMITTER) Q3.2(EMITTER) Q4.2(EMITTER) Q5.2(EMITTER) Q6.2(EMITTER) R23.1 R24.1 R25.1 R26.1 R27.1 U11.8(VCC2) U12.8(VCC)
GND: C36.2 C37.2 J1.1 J1.37 J1.38 J2.1 J2.37 J2.38 LED0.2(CATHODE) LED1.2(CATHODE) LED2.2(CATHODE) LED3.2(CATHODE) U10.2(GND) U11.4(GND) U12.1(A0) U12.2(A1) U12.3(A2) U12.4(GND) U12.7(WP)
VCC: J1.2 J2.2
_A2: J2.6 RN1.6
_A3: J2.8 RN2.8
_A4: J2.10 RN2.6
_A5: J2.12 RN3.8
_A6: J2.14 RN3.6
_A7: J2.16 RN4.8
_A8: J2.18 RN4.6
_A9: J2.20 RN5.8
_A10: J2.22 RN5.6
_A11: J2.24 RN6.8
_A12: J2.26 RN6.6
_A13: J2.28 RN7.8
_B1: J2.3 RN1.7
_B3: J2.5 RN1.5
_B4: J2.7 RN2.7
_B5: J2.9 RN2.5
_B6: J2.11 RN3.7
_B7: J2.13 RN3.5
_B8: J2.15 RN4.7
_B9: J2.17 RN4.5
_B10: J2.19 RN5.7
_B11: J2.21 RN5.5
_B12: J2.23 RN6.7
_B13: J2.25 RN6.5
_C2: J2.4 RN1.8
_C6: J2.29 RN7.5
_C8: J2.34 RN8.6
_D5: J2.27 RN7.7
_D6: J2.30 RN7.6
_D8: J2.33 RN8.5
_E7: J2.32 RN8.8
_E8: J2.36 RN9.8
_E9: J2.35 RN9.7
_F8: J2.31 RN8.7
_K9: J1.31 RN12.4
_L9: J1.30 RN13.1
_L10: J1.29 RN13.2
_M9: J1.28 RN13.3
_N2: J1.36 RN11.3
_P1: J1.35 RN11.4
_P2: J1.34 RN12.1
_P3: J1.26 RN15.1
_P8: J1.32 RN12.3
_R1: J1.33 RN12.2
_R3: J1.24 RN15.3
_R4: J1.22 RN17.1
_R5: J1.20 RN17.3
_R6: J1.18 RN18.1
_R7: J1.16 RN18.3
_R8: J1.14 RN20.1
_R9: J1.12 RN20.3
_R10: J1.10 RN21.1
_R11: J1.8 RN21.3
_R12: J1.6 RN22.1
_R13: J1.4 RN22.3
_T2: J1.27 RN13.4
_T3: J1.25 RN15.2
_T4: J1.23 RN15.4
_T5: J1.21 RN17.2
_T6: J1.19 RN17.4
_T7: J1.17 RN18.2
_T8: J1.15 RN18.4
_T9: J1.13 RN20.2
_T10: J1.11 RN20.4
_T11: J1.9 RN21.2
_T12: J1.7 RN21.4
_T13: J1.5 RN22.2
_T14: J1.3 RN22.4
A2: RN1.3
A3: RN2.1
A4: RN2.3
A5: RN3.1
A6: RN3.3
A7: RN4.1
A8: RN4.3
A9: RN5.1
A10: RN5.3
A11: RN6.1
A12: RN6.3
A13: RN7.1
B1: RN1.2
B3: RN1.4
B4: RN2.2
B5: RN2.4
B6: RN3.2
B7: RN3.4
B8: RN4.2
B9: RN4.4
B10: RN5.2
B11: RN5.4
B12: RN6.2
B13: RN6.4
C2: RN1.1
C6: RN7.4
C8: RN8.3
D5: RN7.2
D6: RN7.3
D8: RN8.4
DIG0: RN14.7
DIG1: RN10.5
DIG2: RN10.7
DIG3: RN14.6
DIG4: RN10.8
DIG5: RN14.8
DIG6: RN10.6
DIG7: RN14.5
E7: RN8.1
E8: RN9.1
E9: RN9.2
F8: RN8.2
K9: RN12.5
L9: RN13.8
L10: RN13.7
LED0: RN34.4
LED1: RN34.3
LED2: RN34.2
LED3: RN34.1
LED_A: RN14.2 U13.11
LED_B: RN10.4 U13.7
LED_C: RN10.2 U13.4
LED_D: RN14.3 U13.1
LED_E: RN10.1 U13.3
LED_F: RN14.1 U13.10
LED_G: RN10.3 U13.6
LED_H: RN14.4 U13.2
M9: RN13.6
N2: RN11.6
P1: RN11.5
P2: RN12.8
P3: RN15.8
P8: RN12.6
R1: RN12.7
R3: RN15.6
R4: RN17.8
R5: RN17.6
R6: RN18.8
R7: RN18.6
R8: RN20.8
R9: RN20.6
R10: RN21.8
R11: RN21.6
R12: RN22.8
R13: RN22.6
RTC_DATA: R25.2 U11.6(I/O)
RTC_NRST: R26.2 U11.5(~{RST})
RTC_SCLK: R27.2 U11.7(SCLK)
SCL: R23.2 U12.6(SCL)
SDA: R24.2 U12.5(SDA)
SEL0: RN16.8
SEL0_T: Q1.1(BASE) RN16.1
SEL0_TT: Q1.3(COLLECTOR) U13.14
SEL1: RN16.7
SEL1_T: Q2.1(BASE) RN16.2
SEL1_TT: Q2.3(COLLECTOR) U13.13
SEL2: RN16.6
SEL2_T: Q3.1(BASE) RN16.3
SEL2_TT: Q3.3(COLLECTOR) U13.12
SEL3: RN16.5
SEL3_T: Q4.1(BASE) RN16.4
SEL3_TT: Q4.3(COLLECTOR) U13.9
SEL4: RN19.8
SEL4_T: Q5.1(BASE) RN19.1
SEL4_TT: Q5.3(COLLECTOR) U13.8
SEL5: RN19.7
SEL5_T: Q6.1(BASE) RN19.2
SEL5_TT: Q6.3(COLLECTOR) U13.5
T2: RN13.5
T3: RN15.7
T4: RN15.5
T5: RN17.7
T6: RN17.5
T7: RN18.7
T8: RN18.5
T9: RN20.7
T10: RN20.5
T11: RN21.7
T12: RN21.5
T13: RN22.7
T14: RN22.5
NetLED0_1: LED0.1(ANODE) RN34.5
NetLED1_1: LED1.1(ANODE) RN34.6
NetLED2_1: LED2.1(ANODE) RN34.7
NetLED3_1: LED3.1(ANODE) RN34.8
NetU10_1: U10.1(VBAT) U11.1(VCC1)
NetU11_2: U11.2(X1) Y1.1
NetU11_3: U11.3(X2) Y1.2

Not connected (* = marked no-connect by the designer): RN9 3* 4* 5* 6*; RN11 1* 2* 7* 8*; RN19 3 4 5 6

### Buses and harness runs
bus DIG[0..7]
bus SEL[0..5]

### Notes on the sheet
- Title
- Size:
- Date:
- Orcad B
- Number:
- Time:
- Revision:
- Sheet
- of
- File:
- (in symbol battery) +; -

### Library data of the parts
C36 = C_Dup3
C37 = C_Dup4
J1 J2 = MHDR2X20: Header, 20-Pin, Dual row; LatestRevisionDate: 17-Jul-2002; LatestRevisionNote: Re-released for DXP Platform.; Publisher: Altium Limited
LED0-LED3 = LED_Dup1
Q1-Q6 = PNP
R23 R24 = R_Dup6
R25-R27 = R_Dup5
RN1-RN9 RN11-RN13 RN15 RN17 RN18 RN20-RN22 = RN_Dup1
RN10 RN14 RN16 RN19 RN34 = RN
U11 = DS1302_8SO: Part Number: TMP-13; ICA_PARTNUM: $$2098133$$DS1302S; ICA_MFR_NAME: MAXIM INTEGRATED PRODUCTS INC
U12 = 24LC04B_0
Y1 = ZTA

## Sheet 7_VGA.SchDoc: AX301  Http://www.heijin.org
size OrCAD B; DocumentNumber: 7; SheetNumber: 7; SheetTotal: 7; PageSetup: Record=PageOptions|CenterHorizontal=True|CenterVertical=True|PrintScale=0.75|XCorrection=1.00|YCorrection=1.00|PrintKind=0|BorderSize=5000000|LeftOffset=0|BottomOffset=0|Orientation=2|PaperLength=1000|PaperWidth=1000|Scale=100|PaperSource=7|PrintQuality=-4|MediaType=1|DitherType=10|PrintScaleMode=1|PaperKind=A4|PaperIndex=9
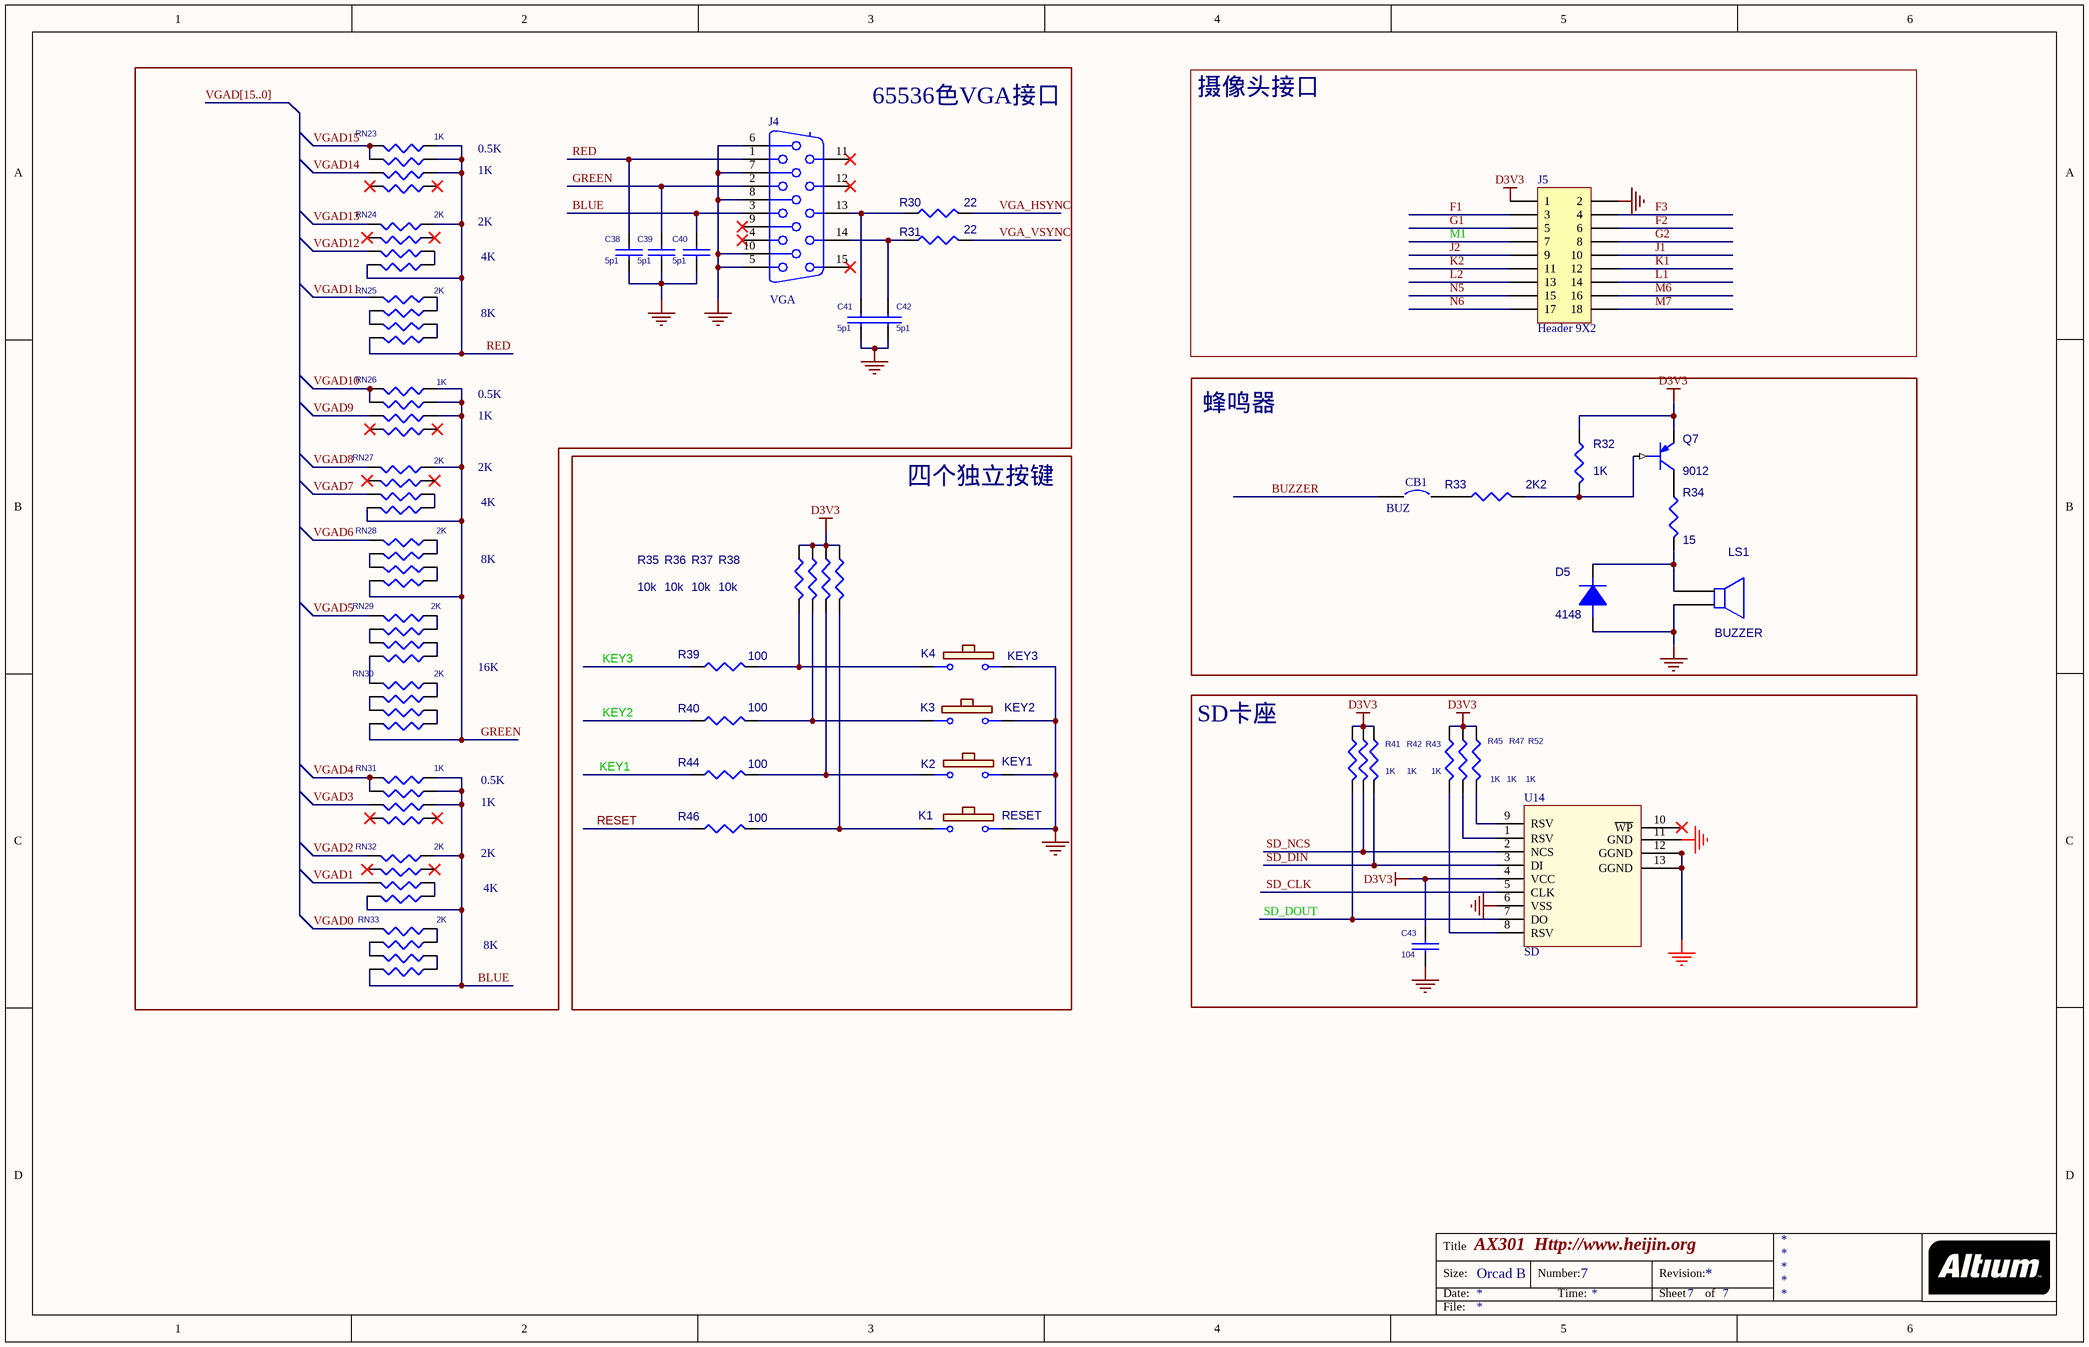
[diagram p6: 7_VGA.SchDoc]

### Parts
C38  5p1  [0603]
C39  5p1  [0603]
C40  5p1  [0603]
C41  5p1  [0603]
C42  5p1  [0603]
C43  104  [0402]
CB1  BUZ  [SIP2]
D5  4148  [1206A]
J4  VGA  [VGA]
J5  Header 9X2  [HDR2X9]
K1  RESET  [KEY735SO]
K2  KEY1  [KEY735SO]
K3  KEY2  [KEY735SO]
K4  KEY3  [KEY735SO]
LS1  BUZZER  [BUZZER]
Q7  9012  [SOT23]
R30  22  [0603]
R31  22  [0603]
R32  1K  [0603]
R33  2K2  [0603]
R34  15  [0603]
R35  10k  [0603]
R36  10k  [0603]
R37  10k  [0603]
R38  10k  [0603]
R39  100  [0603]
R40  100  [0603]
R41  1K  [0603]
R42  1K  [0603]
R43  1K  [0603]
R44  100  [0603]
R45  1K  [0603]
R46  100  [0603]
R47  1K  [0603]
R52  1K  [0603]
RN23  1K  [RN-8P]
RN24  2K  [RN-8P]
RN25  2K  [RN-8P]
RN26  1K  [RN-8P]
RN27  2K  [RN-8P]
RN28  2K  [RN-8P]
RN29  2K  [RN-8P]
RN30  2K  [RN-8P]
RN31  1K  [RN-8P]
RN32  2K  [RN-8P]
RN33  2K  [RN-8P]
U14  SD  [TF]

### Blocks framed on the sheet
65536色VGA接口: C38-C42 J4 R30 R31 RN23-RN33
摄像头接口: J5
蜂鸣器: CB1 D5 LS1 Q7 R32-R34
四个独立按键: K1-K4 R35-R40 R44 R46
SD卡座: C43 R41-R43 R45 R47 R52 U14

### Nets
D3V3: C43.1 J5.1 Q7.2(EMITTER) R32.1 R35.1 R36.1 R37.1 R38.1 R41.1 R42.1 R43.1 R45.1 R47.1 R52.1 U14.4(VCC)
GND: C38.2 C39.2 C40.2 C41.2 C42.2 C43.2 D5.1(A) J4.5 J4.6 J4.7 J4.8 J4.10 J5.2 K1.2 K2.2 K3.1 K4.2 LS1.2 U14.6(VSS) U14.11(GND) U14.12(GGND) U14.13(GGND)
BLUE: C40.1 J4.3 RN31.2 RN31.3 RN31.4 RN32.4 RN32.8 RN33.8
BUZZER: CB1.1
F1: J5.3
F2: J5.6
F3: J5.4
G1: J5.5
G2: J5.8
GREEN: C39.1 J4.2 RN26.2 RN26.3 RN26.4 RN27.4 RN27.8 RN28.8 RN30.8
J1: J5.10
J2: J5.9
K1: J5.12
K2: J5.11
KEY1: R44.1
KEY2: R40.1
KEY3: R39.1
L1: J5.14
L2: J5.13
M1: J5.7
M6: J5.16
M7: J5.18
N5: J5.15
N6: J5.17
RED: C38.1 J4.1 RN23.2 RN23.3 RN23.4 RN24.4 RN24.8 RN25.8
RESET: R46.1
SD_CLK: U14.5(CLK)
SD_DIN: R43.2 U14.3(DI)
SD_DOUT: R41.2 U14.7(DO)
SD_NCS: R42.2 U14.2(NCS)
VGA_HSYNC: R30.2
VGA_VSYNC: R31.2
VGAD0: RN33.5
VGAD1: RN32.7
VGAD2: RN32.5
VGAD3: RN31.7
VGAD4: RN31.5 RN31.6
VGAD5: RN29.5
VGAD6: RN28.5
VGAD7: RN27.7
VGAD8: RN27.5
VGAD9: RN26.7
VGAD10: RN26.5 RN26.6
VGAD11: RN25.5
VGAD12: RN24.7
VGAD13: RN24.5
VGAD14: RN23.7
VGAD15: RN23.5 RN23.6
NetC41_1: C41.1 J4.13 R30.1
NetC42_1: C42.1 J4.14 R31.1
NetCB1_2: CB1.2 R33.1
NetD5_2: D5.2(C) LS1.1 R34.2
NetK1_1: K1.1 R38.2 R46.2
NetK2_1: K2.1 R37.2 R44.2
NetK3_2: K3.2 R36.2 R40.2
NetK4_1: K4.1 R35.2 R39.2
NetQ7_1: Q7.1(BASE) R32.2 R33.2
NetQ7_3: Q7.3(COLLECTOR) R34.1
NetR45_2: R45.2 U14.8(RSV)
NetR47_2: R47.2 U14.1(RSV)
NetR52_2: R52.2 U14.9(RSV)
NetRN24_1: RN24.1 RN24.2
NetRN25_1: RN25.1 RN25.2
NetRN25_3: RN25.3 RN25.4
NetRN25_6: RN25.6 RN25.7
NetRN27_1: RN27.1 RN27.2
NetRN28_1: RN28.1 RN28.2
NetRN28_3: RN28.3 RN28.4
NetRN28_6: RN28.6 RN28.7
NetRN29_1: RN29.1 RN29.2
NetRN29_3: RN29.3 RN29.4
NetRN29_6: RN29.6 RN29.7
NetRN29_8: RN29.8 RN30.5
NetRN30_1: RN30.1 RN30.2
NetRN30_3: RN30.3 RN30.4
NetRN30_6: RN30.6 RN30.7
NetRN32_1: RN32.1 RN32.2
NetRN33_1: RN33.1 RN33.2
NetRN33_3: RN33.3 RN33.4
NetRN33_6: RN33.6 RN33.7

Not connected (* = marked no-connect by the designer): J4 4* 9* 11* 12* 15* 16(MH1) 17(MH2); RN23 1* 8*; RN24 3* 6*; RN26 1* 8*; RN27 3* 6*; RN31 1* 8*; RN32 3* 6*; U14 10(~{WP})*

### Buses and harness runs
bus VGAD[15..0]

### Notes on the sheet
- 0.5K
- 1K
- 2K
- 4K
- 8K
- 16K
- Title
- Size:
- Date:
- Orcad B
- Number:
- Time:
- Revision:
- Sheet
- of
- File:

### Library data of the parts
C38-C43 = C_Dup1
CB1 = Circuit Breaker: Published: 24-Mar-1999; LatestRevisionDate: 17-Jul-2002; LatestRevisionNote: Re-released for DXP Platform.; PackageReference: SPST-2; Publisher: Altium Limited; PackageDescription: Switch; 2 Leads
J4 = Connector 15: Receptacle Assembly, 15-Pin, Sim Line Connector; PackageDocument: B; Positions: 15; Gender: Receptacle Header; Published: 15-Jun-2001; LatestRevisionDate: 17-Jul-2002; LatestRevisionNote: Re-released for DXP Platform.; DatasheetDocument: 24-Nov-1999; PackageReference: 788574; Publisher: Altium Limited; Orientation: Right Angle
J5 = Header 9X2: Header, 9-Pin, Dual row; LatestRevisionDate: 17-Jul-2002; LatestRevisionNote: Re-released for DXP Platform.; Publisher: Altium Limited
K1-K4 = KEYB
LS1 = SPEAKER
Q7 = PNP
R30 R31 R41-R43 R45 R47 R52 = R
R32-R34 = R_Dup3
R35-R40 R44 R46 = R_Dup2
RN23-RN33 = RN_Dup1

## Nets that join several sheets
D1V2: 1_POWER (5 pins), 4_FPGA (15 pins)
D2V5: 1_POWER (5 pins), 4_FPGA (11 pins)
D3V3: 1_POWER (11 pins), 4_FPGA (47 pins), 5_SDRAM (15 pins), 6_DIG (19 pins), 7_VGA (15 pins)
GND: 1_POWER (25 pins), 4_FPGA (71 pins), 5_SDRAM (15 pins), 6_DIG (19 pins), 7_VGA (22 pins)
VCC: 1_POWER (11 pins), 6_DIG (J1.2 J2.2)
A2: 3_FPGA (U3.A2), 6_DIG (RN1.3)
A3: 3_FPGA (U3.A3), 6_DIG (RN2.1)
A4: 3_FPGA (U3.A4), 6_DIG (RN2.3)
A5: 3_FPGA (U3.A5), 6_DIG (RN3.1)
A6: 3_FPGA (U3.A6), 6_DIG (RN3.3)
A7: 3_FPGA (U3.A7), 6_DIG (RN4.1)
A8: 3_FPGA (U3.A8), 6_DIG (RN4.3)
A9: 3_FPGA (U3.A9), 6_DIG (RN5.1)
A10: 3_FPGA (U3.A10), 6_DIG (RN5.3)
A11: 3_FPGA (U3.A11), 6_DIG (RN6.1)
A12: 3_FPGA (U3.A12), 6_DIG (RN6.3)
A13: 3_FPGA (U3.A13), 6_DIG (RN7.1)
ASDO: 2_FPGA (U3.C1), 4_FPGA (U8.5)
B1: 2_FPGA (U3.B1), 6_DIG (RN1.2)
B3: 3_FPGA (U3.B3), 6_DIG (RN1.4)
B4: 3_FPGA (U3.B4), 6_DIG (RN2.2)
B5: 3_FPGA (U3.B5), 6_DIG (RN2.4)
B6: 3_FPGA (U3.B6), 6_DIG (RN3.2)
B7: 3_FPGA (U3.B7), 6_DIG (RN3.4)
B8: 3_FPGA (U3.B8), 6_DIG (RN4.2)
B9: 3_FPGA (U3.B9), 6_DIG (RN4.4)
B10: 3_FPGA (U3.B10), 6_DIG (RN5.2)
B11: 3_FPGA (U3.B11), 6_DIG (RN5.4)
B12: 3_FPGA (U3.B12), 6_DIG (RN6.2)
B13: 3_FPGA (U3.B13), 6_DIG (RN6.4)
BUZZER: 3_FPGA (U3.C11), 7_VGA (CB1.1)
C2: 2_FPGA (U3.C2), 6_DIG (RN1.1)
C6: 3_FPGA (U3.C6), 6_DIG (RN7.4)
C8: 3_FPGA (U3.C8), 6_DIG (RN8.3)
D5: 3_FPGA (U3.D5), 6_DIG (RN7.2)
D6: 3_FPGA (U3.D6), 6_DIG (RN7.3)
D8: 3_FPGA (U3.D8), 6_DIG (RN8.4)
DATA0: 2_FPGA (U3.H2), 4_FPGA (R5.1)
DIG0: 2_FPGA (U3.R14), 6_DIG (RN14.7)
DIG1: 3_FPGA (U3.N16), 6_DIG (RN10.5)
DIG2: 3_FPGA (U3.P16), 6_DIG (RN10.7)
DIG3: 2_FPGA (U3.T15), 6_DIG (RN14.6)
DIG4: 3_FPGA (U3.P15), 6_DIG (RN10.8)
DIG5: 2_FPGA (U3.N12), 6_DIG (RN14.8)
DIG6: 3_FPGA (U3.N15), 6_DIG (RN10.6)
DIG7: 3_FPGA (U3.R16), 6_DIG (RN14.5)
E7: 3_FPGA (U3.E7), 6_DIG (RN8.1)
E8: 3_FPGA (U3.E8), 6_DIG (RN9.1)
E9: 3_FPGA (U3.E9), 6_DIG (RN9.2)
F1: 2_FPGA (U3.F1), 7_VGA (J5.3)
F2: 2_FPGA (U3.F2), 7_VGA (J5.6)
F3: 2_FPGA (U3.F3), 7_VGA (J5.4)
F8: 3_FPGA (U3.F8), 6_DIG (RN8.2)
G1: 2_FPGA (U3.G1), 7_VGA (J5.5)
G2: 2_FPGA (U3.G2), 7_VGA (J5.8)
J1: 2_FPGA (U3.J1), 7_VGA (J5.10)
J2: 2_FPGA (U3.J2), 7_VGA (J5.9)
K1: 2_FPGA (U3.K1), 7_VGA (J5.12)
K2: 2_FPGA (U3.K2), 7_VGA (J5.11)
K9: 2_FPGA (U3.K9), 6_DIG (RN12.5)
KEY1: 4_FPGA (U3.M15), 7_VGA (R44.1)
KEY2: 4_FPGA (U3.M16), 7_VGA (R40.1)
KEY3: 4_FPGA (U3.E16), 7_VGA (R39.1)
L1: 2_FPGA (U3.L1), 7_VGA (J5.14)
L2: 2_FPGA (U3.L2), 7_VGA (J5.13)
L9: 2_FPGA (U3.L9), 6_DIG (RN13.8)
L10: 2_FPGA (U3.L10), 6_DIG (RN13.7)
LED0: 3_FPGA (U3.E10), 6_DIG (RN34.4)
LED1: 3_FPGA (U3.F9), 6_DIG (RN34.3)
LED2: 3_FPGA (U3.C9), 6_DIG (RN34.2)
LED3: 3_FPGA (U3.D9), 6_DIG (RN34.1)
M1: 4_FPGA (U3.M1), 7_VGA (J5.7)
M6: 2_FPGA (U3.M6), 7_VGA (J5.16)
M7: 2_FPGA (U3.M7), 7_VGA (J5.18)
M9: 2_FPGA (U3.M9), 6_DIG (RN13.6)
N2: 2_FPGA (U3.N2), 6_DIG (RN11.6)
N5: 2_FPGA (U3.N5), 7_VGA (J5.15)
N6: 2_FPGA (U3.N6), 7_VGA (J5.17)
nCSO: 2_FPGA (U3.D2), 4_FPGA (U8.1)
P1: 2_FPGA (U3.P1), 6_DIG (RN11.5)
P2: 2_FPGA (U3.P2), 6_DIG (RN12.8)
P3: 2_FPGA (U3.P3), 6_DIG (RN15.8)
P8: 2_FPGA (U3.P8), 6_DIG (RN12.6)
R1: 2_FPGA (U3.R1), 6_DIG (RN12.7)
R3: 2_FPGA (U3.R3), 6_DIG (RN15.6)
R4: 2_FPGA (U3.R4), 6_DIG (RN17.8)
R5: 2_FPGA (U3.R5), 6_DIG (RN17.6)
R6: 2_FPGA (U3.R6), 6_DIG (RN18.8)
R7: 2_FPGA (U3.R7), 6_DIG (RN18.6)
R8: 2_FPGA (U3.R8), 6_DIG (RN20.8)
R9: 2_FPGA (U3.R9), 6_DIG (RN20.6)
R10: 2_FPGA (U3.R10), 6_DIG (RN21.8)
R11: 2_FPGA (U3.R11), 6_DIG (RN21.6)
R12: 2_FPGA (U3.R12), 6_DIG (RN22.8)
R13: 2_FPGA (U3.R13), 6_DIG (RN22.6)
RESET: 3_FPGA (U3.N13), 7_VGA (R46.1)
RTC_DATA: 2_FPGA (U3.M8), 6_DIG (R25.2 U11.6)
RTC_NRST: 2_FPGA (U3.N8), 6_DIG (R26.2 U11.5)
RTC_SCLK: 2_FPGA (U3.P6), 6_DIG (R27.2 U11.7)
RXD: 1_POWER (R7.1 U4.26), 4_FPGA (U3.M2)
S_A0: 3_FPGA (U3.F11), 5_SDRAM (U9.23)
S_A1: 3_FPGA (U3.E11), 5_SDRAM (U9.24)
S_A2: 3_FPGA (U3.D14), 5_SDRAM (U9.25)
S_A3: 3_FPGA (U3.C14), 5_SDRAM (U9.26)
S_A4: 3_FPGA (U3.A14), 5_SDRAM (U9.29)
S_A5: 3_FPGA (U3.A15), 5_SDRAM (U9.30)
S_A6: 3_FPGA (U3.B16), 5_SDRAM (U9.31)
S_A7: 3_FPGA (U3.C15), 5_SDRAM (U9.32)
S_A8: 3_FPGA (U3.C16), 5_SDRAM (U9.33)
S_A9: 3_FPGA (U3.D15), 5_SDRAM (U9.34)
S_A10: 3_FPGA (U3.F14), 5_SDRAM (U9.22)
S_A11: 3_FPGA (U3.D16), 5_SDRAM (U9.35)
S_A12: 3_FPGA (U3.F15), 5_SDRAM (U9.36)
S_BA0: 3_FPGA (U3.G11), 5_SDRAM (U9.20)
S_BA1: 3_FPGA (U3.F13), 5_SDRAM (U9.21)
S_CKE: 3_FPGA (U3.F16), 5_SDRAM (U9.37)
S_CLK: 3_FPGA (U3.B14), 5_SDRAM (U9.38)
S_DB0: 2_FPGA (U3.P14), 5_SDRAM (U9.2)
S_DB1: 3_FPGA (U3.M12), 5_SDRAM (U9.4)
S_DB2: 3_FPGA (U3.N14), 5_SDRAM (U9.5)
S_DB3: 3_FPGA (U3.L12), 5_SDRAM (U9.7)
S_DB4: 3_FPGA (U3.L13), 5_SDRAM (U9.8)
S_DB5: 3_FPGA (U3.L14), 5_SDRAM (U9.10)
S_DB6: 2_FPGA (U3.L11), 5_SDRAM (U9.11)
S_DB7: 3_FPGA (U3.K12), 5_SDRAM (U9.13)
S_DB8: 3_FPGA (U3.G16), 5_SDRAM (U9.42)
S_DB9: 3_FPGA (U3.J11), 5_SDRAM (U9.44)
S_DB10: 3_FPGA (U3.J16), 5_SDRAM (U9.45)
S_DB11: 3_FPGA (U3.J15), 5_SDRAM (U9.47)
S_DB12: 3_FPGA (U3.K16), 5_SDRAM (U9.48)
S_DB13: 3_FPGA (U3.K15), 5_SDRAM (U9.50)
S_DB14: 3_FPGA (U3.L16), 5_SDRAM (U9.51)
S_DB15: 3_FPGA (U3.L15), 5_SDRAM (U9.53)
S_DQM0: 3_FPGA (U3.J14), 5_SDRAM (U9.15)
S_DQM1: 3_FPGA (U3.G15), 5_SDRAM (U9.39)
S_NCAS: 3_FPGA (U3.J12), 5_SDRAM (U9.17)
S_NCS: 2_FPGA (U3.K10), 5_SDRAM (U9.19)
S_NRAS: 3_FPGA (U3.K11), 5_SDRAM (U9.18)
S_NWE: 3_FPGA (U3.J13), 5_SDRAM (U9.16)
SCL: 2_FPGA (U3.D1), 6_DIG (R23.2 U12.6)
SD_CLK: 3_FPGA (U3.D12), 7_VGA (U14.5)
SD_DIN: 3_FPGA (U3.F10), 7_VGA (R43.2 U14.3)
SD_DOUT: 4_FPGA (U3.E15), 7_VGA (R41.2 U14.7)
SD_NCS: 3_FPGA (U3.D11), 7_VGA (R42.2 U14.2)
SDA: 3_FPGA (U3.E6), 6_DIG (R24.2 U12.5)
SEL0: 2_FPGA (U3.N9), 6_DIG (RN16.8)
SEL1: 2_FPGA (U3.P9), 6_DIG (RN16.7)
SEL2: 2_FPGA (U3.M10), 6_DIG (RN16.6)
SEL3: 2_FPGA (U3.N11), 6_DIG (RN16.5)
SEL4: 2_FPGA (U3.P11), 6_DIG (RN19.8)
SEL5: 2_FPGA (U3.M11), 6_DIG (RN19.7)
T2: 2_FPGA (U3.T2), 6_DIG (RN13.5)
T3: 2_FPGA (U3.T3), 6_DIG (RN15.7)
T4: 2_FPGA (U3.T4), 6_DIG (RN15.5)
T5: 2_FPGA (U3.T5), 6_DIG (RN17.7)
T6: 2_FPGA (U3.T6), 6_DIG (RN17.5)
T7: 2_FPGA (U3.T7), 6_DIG (RN18.7)
T8: 2_FPGA (U3.T8), 6_DIG (RN18.5)
T9: 2_FPGA (U3.T9), 6_DIG (RN20.7)
T10: 2_FPGA (U3.T10), 6_DIG (RN20.5)
T11: 2_FPGA (U3.T11), 6_DIG (RN21.7)
T12: 2_FPGA (U3.T12), 6_DIG (RN21.5)
T13: 2_FPGA (U3.T13), 6_DIG (RN22.7)
T14: 2_FPGA (U3.T14), 6_DIG (RN22.5)
TXD: 1_POWER (R4.1 U4.25), 2_FPGA (U3.N1)
VGA_HSYNC: 2_FPGA (U3.L6), 7_VGA (R30.2)
VGA_VSYNC: 2_FPGA (U3.N3), 7_VGA (R31.2)
VGAD0: 3_FPGA (U3.C3), 7_VGA (RN33.5)
VGAD1: 2_FPGA (U3.D4), 7_VGA (RN32.7)
VGAD2: 3_FPGA (U3.D3), 7_VGA (RN32.5)
VGAD3: 2_FPGA (U3.E5), 7_VGA (RN31.7)
VGAD4: 3_FPGA (U3.F6), 7_VGA (RN31.5 RN31.6)
VGAD5: 2_FPGA (U3.F5), 7_VGA (RN29.5)
VGAD6: 2_FPGA (U3.G5), 7_VGA (RN28.5)
VGAD7: 3_FPGA (U3.F7), 7_VGA (RN27.7)
VGAD8: 2_FPGA (U3.K8), 7_VGA (RN27.5)
VGAD9: 2_FPGA (U3.L8), 7_VGA (RN26.7)
VGAD10: 2_FPGA (U3.J6), 7_VGA (RN26.5 RN26.6)
VGAD11: 2_FPGA (U3.K6), 7_VGA (RN25.5)
VGAD12: 2_FPGA (U3.K5), 7_VGA (RN24.7)
VGAD13: 2_FPGA (U3.L7), 7_VGA (RN24.5)
VGAD14: 2_FPGA (U3.L3), 7_VGA (RN23.7)
VGAD15: 2_FPGA (U3.L4), 7_VGA (RN23.5 RN23.6)